# Altium project WunderBar_v102b.PrjPCB
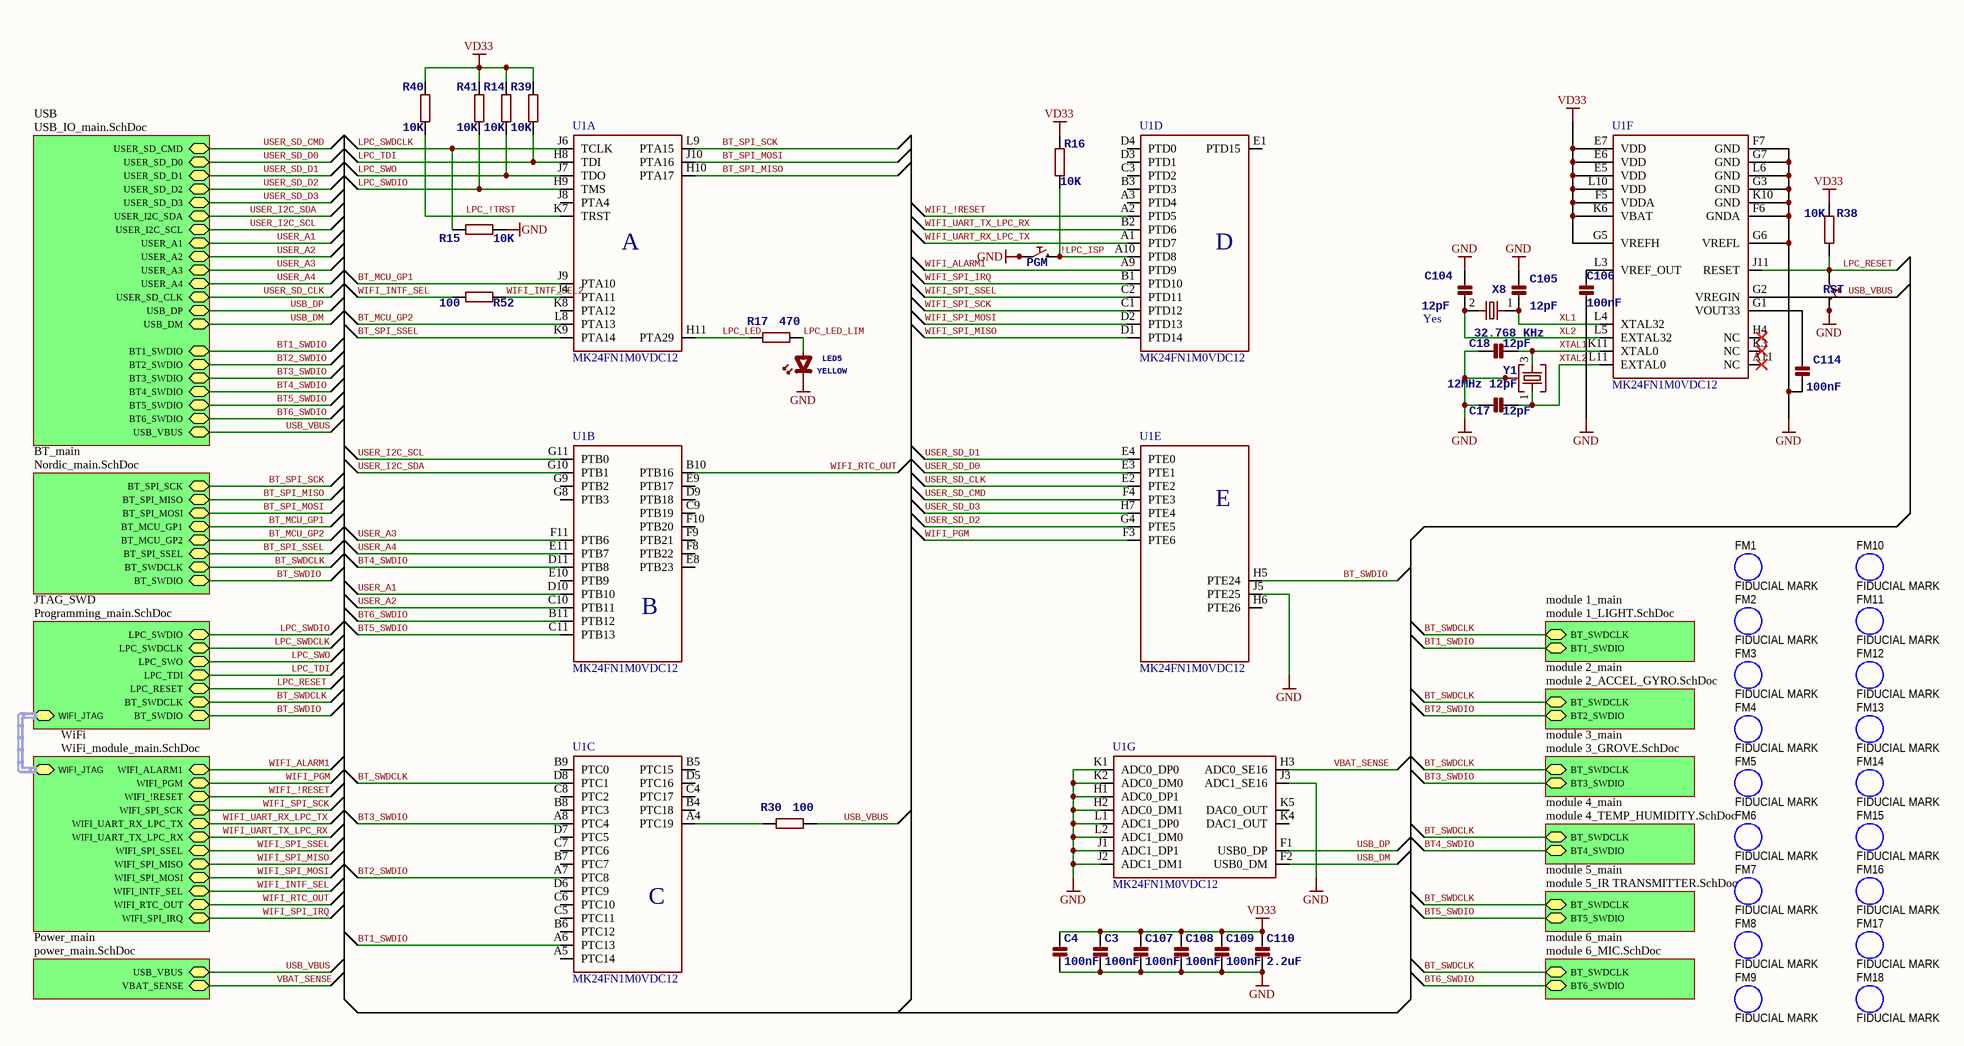
[diagram p0: WunderBar_v102b.SchDoc]
12 sheets, 377 parts. Net scope: hierarchical (ports join the sheet entries above them; power ports are global).
Board file: WunderBar_v102b.PcbDoc
Sheets:
  WunderBar_v102b.SchDoc
    WiFi = WiFi_module_main.SchDoc
    BT_main = Nordic_main.SchDoc
    USB = USB_IO_main.SchDoc
    JTAG_SWD = Programming_main.SchDoc
    module 1_main = module 1_LIGHT.SchDoc
    module 2_main = module 2_ACCEL_GYRO.SchDoc
    module 3_main = module 3_GROVE.SchDoc
    module 4_main = module 4_TEMP_HUMIDITY.SchDoc
    module 5_main = module 5_IR TRANSMITTER.SchDoc
    module 6_main = module 6_MIC.SchDoc
    Power_main = power_main.SchDoc

## Sheet WunderBar_v102b.SchDoc
size A2

### Parts
C3  100nF  [0402]
C4  100nF  [0402]
C17  12pF  [0402]
C18  12pF  [0402]
C104  12pF  SMD: Yes  [0402]
C105  12pF  [0402]
C106  100nF  [0402]
C107  100nF  [0402]
C108  100nF  [0402]
C109  100nF  [0402]
C110  2.2uF  [0603]
C114  100nF  [0402]
FM1  FIDUCIAL MARK  [FIDUCIAL MARK 0.6MM]  (no BOM)
FM2  FIDUCIAL MARK  [FIDUCIAL MARK 0.6MM]  (no BOM)
FM3  FIDUCIAL MARK  [FIDUCIAL MARK 0.6MM]  (no BOM)
FM4  FIDUCIAL MARK  [FIDUCIAL MARK 0.6MM]  (no BOM)
FM5  FIDUCIAL MARK  [FIDUCIAL MARK 0.6MM]  (no BOM)
FM6  FIDUCIAL MARK  [FIDUCIAL MARK 0.6MM]  (no BOM)
FM7  FIDUCIAL MARK  [FIDUCIAL MARK 0.6MM]  (no BOM)
FM8  FIDUCIAL MARK  [FIDUCIAL MARK 0.6MM]  (no BOM)
FM9  FIDUCIAL MARK  [FIDUCIAL MARK 0.6MM]  (no BOM)
FM10  FIDUCIAL MARK  [FIDUCIAL MARK 0.6MM]  (no BOM)
FM11  FIDUCIAL MARK  [FIDUCIAL MARK 0.6MM]  (no BOM)
FM12  FIDUCIAL MARK  [FIDUCIAL MARK 0.6MM]  (no BOM)
FM13  FIDUCIAL MARK  [FIDUCIAL MARK 0.6MM]  (no BOM)
FM14  FIDUCIAL MARK  [FIDUCIAL MARK 0.6MM]  (no BOM)
FM15  FIDUCIAL MARK  [FIDUCIAL MARK 0.6MM]  (no BOM)
FM16  FIDUCIAL MARK  [FIDUCIAL MARK 0.6MM]  (no BOM)
FM17  FIDUCIAL MARK  [FIDUCIAL MARK 0.6MM]  (no BOM)
FM18  FIDUCIAL MARK  [FIDUCIAL MARK 0.6MM]  (no BOM)
LED5  YELLOW  [0402_POLAR]
PGM  Tact Sw 4.6x2.8  [CK-KMR2]  (value not drawn)
R14  10K  [0402]
R15  10K  [0402]
R16  10K  [0402]
R17  470  [0402]
R30  100  [0402]
R38  10K  [0402]
R39  10K  [0402]
R40  10K  [0402]
R41  10K  [0402]
R52  100  [0402]
RST  Tact Sw 4.6x2.8  [CK-KMR2]  (value not drawn)
U1  MK24FN1M0VDC12  [BGA121-0.65]  (parts A,B,C,D,E,F,G of 7)
X8  32.768 KHz  [1206_MINIMELF_COMBO]
Y1  12MHz 12pF  [ABM8G]

### Sub-sheets
BT_main = Nordic_main.SchDoc: BT_SPI_SCK, BT_SPI_MISO, BT_SPI_MOSI, BT_MCU_GP1, BT_MCU_GP2, BT_SPI_SSEL, BT_SWDCLK, BT_SWDIO
JTAG_SWD = Programming_main.SchDoc: LPC_SWDIO, LPC_SWDCLK, LPC_SWO, LPC_TDI, LPC_RESET, WIFI_JTAG (harness WIFI_JTAG), BT_SWDCLK, BT_SWDIO
module 1_main = module 1_LIGHT.SchDoc: BT_SWDCLK, BT1_SWDIO
module 2_main = module 2_ACCEL_GYRO.SchDoc: BT_SWDCLK, BT2_SWDIO
module 3_main = module 3_GROVE.SchDoc: BT_SWDCLK, BT3_SWDIO
module 4_main = module 4_TEMP_HUMIDITY.SchDoc: BT_SWDCLK, BT4_SWDIO
module 5_main = module 5_IR TRANSMITTER.SchDoc: BT_SWDCLK, BT5_SWDIO
module 6_main = module 6_MIC.SchDoc: BT_SWDCLK, BT6_SWDIO
Power_main = power_main.SchDoc: USB_VBUS, VBAT_SENSE
USB = USB_IO_main.SchDoc: USER_SD_CMD, USER_SD_D0, USER_SD_D1, USER_SD_D2, USER_SD_D3, USER_I2C_SDA, USER_I2C_SCL, USER_A1, USER_A2, USER_A3, USER_A4, USER_SD_CLK, USB_DP, USB_DM, BT1_SWDIO, BT2_SWDIO, BT3_SWDIO, BT4_SWDIO, BT5_SWDIO, BT6_SWDIO, USB_VBUS
WiFi = WiFi_module_main.SchDoc: WIFI_ALARM1, WIFI_PGM, WIFI_!RESET, WIFI_SPI_SCK, WIFI_UART_RX_LPC_TX, WIFI_UART_TX_LPC_RX, WIFI_SPI_SSEL, WIFI_SPI_MISO, WIFI_SPI_MOSI, WIFI_INTF_SEL, WIFI_RTC_OUT, WIFI_SPI_IRQ, WIFI_JTAG (harness WIFI_JTAG)

### Nets
GND: C3.2 C4.2 C17.2 C18.2 C104.2 C105.2 C106.2 C107.2 C108.2 C109.2 C110.2 C114.1 LED5.K(CATHODE) PGM.P1 PGM.P2 R15.2 RST.P3 RST.P4 U1.F6(GNDA) U1.F7(GND) U1.G3(GND) U1.G6(VREFL) U1.G7(GND) U1.H1(ADC0_DP1) U1.H2(ADC0_DM1) U1.J1(ADC1_DP1) U1.J2(ADC1_DM1) U1.J3(ADC1_SE16) U1.J5(PTE25) U1.K1(ADC0_DP0) U1.K2(ADC0_DM0) U1.K10(GND) U1.L1(ADC1_DP0) U1.L2(ADC1_DM0) U1.L6(GND) Y1.2(GND) Y1.4(GND)
USB_VBUS: R30.1 U1.G2(VREGIN) ; sheet USB/USB_VBUS, sheet Power_main/USB_VBUS
VD33: C3.1 C4.1 C107.1 C108.1 C109.1 C110.1 R14.2 R16.2 R38.2 R39.2 R40.2 R41.2 U1.E5(VDD) U1.E6(VDD) U1.E7(VDD) U1.F5(VDDA) U1.G5(VREFH) U1.K6(VBAT) U1.L10(VDD)
!LPC_ISP: PGM.P3 PGM.P4 R16.1 U1.A10(PTD8)
BT1_SWDIO: U1.A6(PTC13) ; sheet USB/BT1_SWDIO, sheet module 1_main/BT1_SWDIO
BT2_SWDIO: U1.A7(PTC8) ; sheet USB/BT2_SWDIO, sheet module 2_main/BT2_SWDIO
BT3_SWDIO: U1.A8(PTC4) ; sheet USB/BT3_SWDIO, sheet module 3_main/BT3_SWDIO
BT4_SWDIO: U1.D11(PTB8) ; sheet USB/BT4_SWDIO, sheet module 4_main/BT4_SWDIO
BT5_SWDIO: U1.C11(PTB13) ; sheet USB/BT5_SWDIO, sheet module 5_main/BT5_SWDIO
BT6_SWDIO: U1.B11(PTB12) ; sheet USB/BT6_SWDIO, sheet module 6_main/BT6_SWDIO
BT_MCU_GP1: U1.J9(PTA10) ; sheet BT_main/BT_MCU_GP1
BT_MCU_GP2: U1.L8(PTA13) ; sheet BT_main/BT_MCU_GP2
BT_SPI_MISO: U1.H10(PTA17) ; sheet BT_main/BT_SPI_MISO
BT_SPI_MOSI: U1.J10(PTA16) ; sheet BT_main/BT_SPI_MOSI
BT_SPI_SCK: U1.L9(PTA15) ; sheet BT_main/BT_SPI_SCK
BT_SPI_SSEL: U1.K9(PTA14) ; sheet BT_main/BT_SPI_SSEL
BT_SWDCLK: U1.D8(PTC1) ; sheet BT_main/BT_SWDCLK, sheet JTAG_SWD/BT_SWDCLK, sheet module 1_main/BT_SWDCLK, sheet module 2_main/BT_SWDCLK, sheet module 3_main/BT_SWDCLK, sheet module 4_main/BT_SWDCLK, sheet module 5_main/BT_SWDCLK, sheet module 6_main/BT_SWDCLK
BT_SWDIO: U1.H5(PTE24) ; sheet BT_main/BT_SWDIO, sheet JTAG_SWD/BT_SWDIO
LPC_!TRST: R40.1 U1.K7(TRST)
LPC_LED: R17.2 U1.H11(PTA29)
LPC_LED_LIM: LED5.A(ANODE) R17.1
LPC_RESET: R38.1 RST.P1 RST.P2 U1.J11(RESET) ; sheet JTAG_SWD/LPC_RESET  [project net ~{LPC_RESET}]
LPC_SWDCLK: R15.1 U1.J6(TCLK) ; sheet JTAG_SWD/LPC_SWDCLK
LPC_SWDIO: R41.1 U1.H9(TMS) ; sheet JTAG_SWD/LPC_SWDIO
LPC_SWO: R14.1 U1.J7(TDO) ; sheet JTAG_SWD/LPC_SWO
LPC_TDI: R39.1 U1.H8(TDI) ; sheet JTAG_SWD/LPC_TDI
USB_DM: U1.F2(USB0_DM) ; sheet USB/USB_DM
USB_DP: U1.F1(USB0_DP) ; sheet USB/USB_DP
USER_A1: U1.D10(PTB10) ; sheet USB/USER_A1
USER_A2: U1.C10(PTB11) ; sheet USB/USER_A2
USER_A3: U1.F11(PTB6) ; sheet USB/USER_A3
USER_A4: U1.E11(PTB7) ; sheet USB/USER_A4
USER_I2C_SCL: U1.G11(PTB0) ; sheet USB/USER_I2C_SCL
USER_I2C_SDA: U1.G10(PTB1) ; sheet USB/USER_I2C_SDA
USER_SD_CLK: U1.E2(PTE2) ; sheet USB/USER_SD_CLK
USER_SD_CMD: U1.F4(PTE3) ; sheet USB/USER_SD_CMD
USER_SD_D0: U1.E3(PTE1) ; sheet USB/USER_SD_D0
USER_SD_D1: U1.E4(PTE0) ; sheet USB/USER_SD_D1
USER_SD_D2: U1.G4(PTE5) ; sheet USB/USER_SD_D2
USER_SD_D3: U1.H7(PTE4) ; sheet USB/USER_SD_D3
VBAT_SENSE: U1.H3(ADC0_SE16) ; sheet Power_main/VBAT_SENSE
WIFI_!RESET: U1.A2(PTD5) ; sheet WiFi/WIFI_!RESET
WIFI_ALARM1: U1.A9(PTD9) ; sheet WiFi/WIFI_ALARM1
WIFI_INTF_SEL: R52.1 ; sheet WiFi/WIFI_INTF_SEL
WIFI_INTF_SEL2: R52.2 U1.J4(PTA11)
WIFI_PGM: U1.F3(PTE6) ; sheet WiFi/WIFI_PGM
WIFI_RTC_OUT: U1.B10(PTB16) ; sheet WiFi/WIFI_RTC_OUT
WIFI_SPI_IRQ: U1.B1(PTD10) ; sheet WiFi/WIFI_SPI_IRQ
WIFI_SPI_MISO: U1.D1(PTD14) ; sheet WiFi/WIFI_SPI_MISO
WIFI_SPI_MOSI: U1.D2(PTD13) ; sheet WiFi/WIFI_SPI_MOSI
WIFI_SPI_SCK: U1.C1(PTD12) ; sheet WiFi/WIFI_SPI_SCK
WIFI_SPI_SSEL: U1.C2(PTD11) ; sheet WiFi/WIFI_SPI_SSEL
WIFI_UART_RX_LPC_TX: U1.A1(PTD7) ; sheet WiFi/WIFI_UART_RX_LPC_TX
WIFI_UART_TX_LPC_RX: U1.B2(PTD6) ; sheet WiFi/WIFI_UART_TX_LPC_RX
XL1: C105.1 U1.L4(XTAL32) X8.1
XL2: C104.1 U1.L5(EXTAL32) X8.2
XTAL1: C18.1 U1.K11(XTAL0) Y1.3
XTAL2: C17.1 U1.L11(EXTAL0) Y1.1
NetC106_1: C106.1 U1.L3(VREF_OUT)
NetC114_2: C114.2 U1.G1(VOUT33)
NetR30_2: R30.2 U1.A4(PTC19)

Not connected (* = marked no-connect by the designer): U1 A3(PTD4) A5(PTC14) A11(NC)* B3(PTD3) B4(PTC18) B5(PTC15) B6(PTC12) B7(PTC7) B8(PTC3) B9(PTC0) C3(PTD2) C4(PTC17) C5(PTC11) C6(PTC10) C7(PTC6) C8(PTC2) C9(PTB19) D3(PTD1) D4(PTD0) D5(PTC16) D6(PTC9) D7(PTC5) D9(PTB18) E1(PTD15) E8(PTB23) E9(PTB17) E10(PTB9) F8(PTB22) F9(PTB21) F10(PTB20) G8(PTB3) G9(PTB2) H4(NC)* H6(PTE26) J8(PTA4) K3(NC)* K4(DAC1_OUT) K5(DAC0_OUT) K8(PTA12)

### Buses and harness runs
harness sheet JTAG_SWD/WIFI_JTAG = sheet WiFi/WIFI_JTAG

### Notes on the sheet
- (in symbol MK24FN1M0VDC12, part A) A
- (in symbol MK24FN1M0VDC12, part B) B
- (in symbol MK24FN1M0VDC12, part C) C
- (in symbol MK24FN1M0VDC12, part D) D
- (in symbol MK24FN1M0VDC12, part E) E

### Library data of the parts
C3 C4 C17 C18 C104-C110 C114 = CAP_CERAMIC0402: Ceramic capacitor
  C3 C4 C17 C18 C105-C110 C114: SMD: Yes
LED5 = LED0402: LED common; SMD: Yes
PGM RST = PUSHBUTTONKMR2XX: Push button; SMD: Yes
R14-R17 R30 R38-R41 R52 = R-EU_0402: RESISTOR; SMD: Yes
U1 = MK24FN1M0VDC12: MK24FN1M0VDC12 121-PIN BGA Microcontroller; SMD: Yes
X8 = CRYSTAL1206: CL05C120JB5; 1: 1; 2: 2; SMD: Yes
Y1 = CRYSTAL_WITH_GROUNDABM8G: CX2520DB16000D0GEJCC; 1: 1; 2: 2; SMD: Yes
FM1-FM18 = FIDUCIAL MARK: SMD: Fiducial

## Sheet WiFi_module_main.SchDoc
size A3
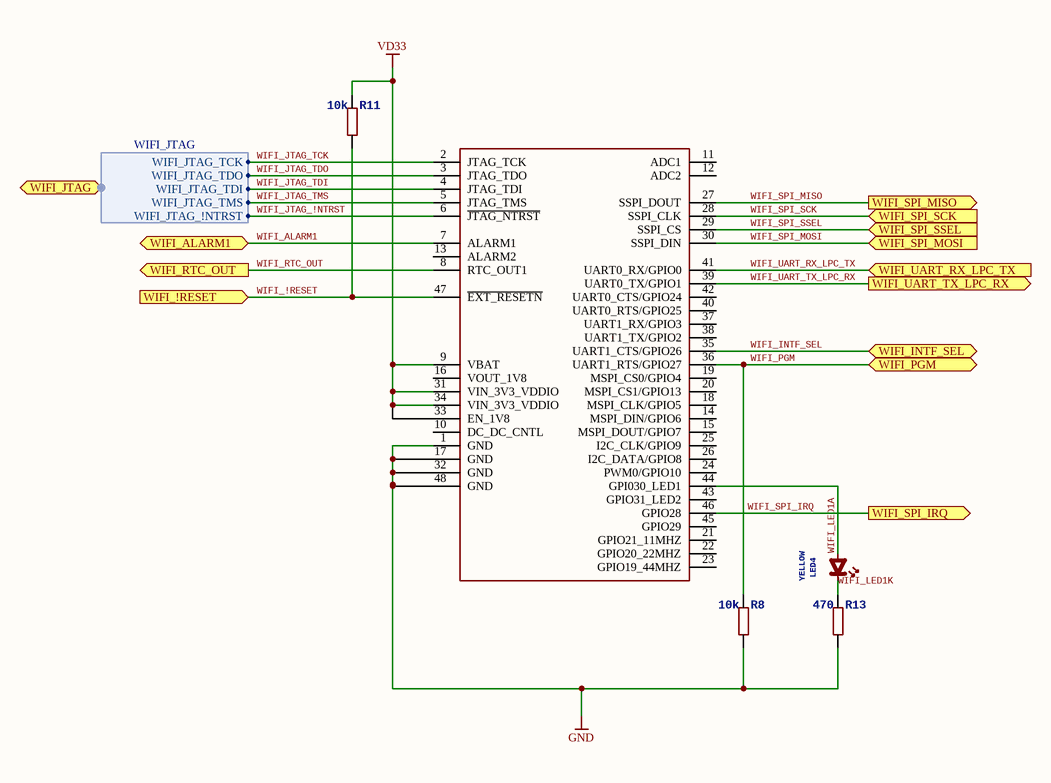
[diagram p1: WiFi_module_main.SchDoc]

### Parts
LED4  YELLOW  [0402_POLAR]
R8  10k  [0402]
R11  10k  [0402]
R13  470  [0402]
WIFI  GS1500M  [GAINSPANM]  (value not drawn)

### Ports
WIFI_!RESET (in), WIFI_ALARM1, WIFI_INTF_SEL, WIFI_JTAG (harness WIFI_JTAG), WIFI_PGM, WIFI_RTC_OUT (out), WIFI_SPI_IRQ (out), WIFI_SPI_MISO (out), WIFI_SPI_MOSI (in), WIFI_SPI_SCK (in), WIFI_SPI_SSEL (in), WIFI_UART_RX_LPC_TX (in), WIFI_UART_TX_LPC_RX (out)

### Harnesses
WIFI_JTAG: WIFI_JTAG_TCK, WIFI_JTAG_TDO, WIFI_JTAG_TDI, WIFI_JTAG_TMS, WIFI_JTAG_!NTRST

### Nets
GND: R8.1 R13.1 WIFI.1(GND) WIFI.17(GND) WIFI.32(GND) WIFI.48(GND)
VD33: R11.2 WIFI.9(VBAT) WIFI.31(VIN_3V3_VDDIO) WIFI.33(EN_1V8) WIFI.34(VIN_3V3_VDDIO)
WIFI_!RESET: R11.1 WIFI.47(~{EXT_RESETN}) ; port WIFI_!RESET
WIFI_ALARM1: WIFI.7(ALARM1) ; port WIFI_ALARM1
WIFI_INTF_SEL: WIFI.35(UART1_CTS/GPIO26) ; port WIFI_INTF_SEL
WIFI_JTAG_!NTRST: WIFI.6(~{JTAG_NTRST}) ; port WIFI_JTAG.WIFI_JTAG_!NTRST
WIFI_JTAG_TCK: WIFI.2(JTAG_TCK) ; port WIFI_JTAG.WIFI_JTAG_TCK
WIFI_JTAG_TDI: WIFI.4(JTAG_TDI) ; port WIFI_JTAG.WIFI_JTAG_TDI
WIFI_JTAG_TDO: WIFI.3(JTAG_TDO) ; port WIFI_JTAG.WIFI_JTAG_TDO
WIFI_JTAG_TMS: WIFI.5(JTAG_TMS) ; port WIFI_JTAG.WIFI_JTAG_TMS
WIFI_LED1A: LED4.A(ANODE) WIFI.44(GPI030_LED1)
WIFI_LED1K: LED4.K(CATHODE) R13.2
WIFI_PGM: R8.2 WIFI.36(UART1_RTS/GPIO27) ; port WIFI_PGM
WIFI_RTC_OUT: WIFI.8(RTC_OUT1) ; port WIFI_RTC_OUT
WIFI_SPI_IRQ: WIFI.46(GPIO28) ; port WIFI_SPI_IRQ
WIFI_SPI_MISO: WIFI.27(SSPI_DOUT) ; port WIFI_SPI_MISO
WIFI_SPI_MOSI: WIFI.30(SSPI_DIN) ; port WIFI_SPI_MOSI
WIFI_SPI_SCK: WIFI.28(SSPI_CLK) ; port WIFI_SPI_SCK
WIFI_SPI_SSEL: WIFI.29(SSPI_CS) ; port WIFI_SPI_SSEL
WIFI_UART_RX_LPC_TX: WIFI.41(UART0_RX/GPIO0) ; port WIFI_UART_RX_LPC_TX
WIFI_UART_TX_LPC_RX: WIFI.39(UART0_TX/GPIO1) ; port WIFI_UART_TX_LPC_RX

Not connected (* = marked no-connect by the designer): WIFI 10(DC_DC_CNTL) 11(ADC1) 12(ADC2) 13(ALARM2) 14(MSPI_DIN/GPIO6) 15(MSPI_DOUT/GPIO7) 16(VOUT_1V8) 18(MSPI_CLK/GPIO5) 19(MSPI_CS0/GPIO4) 20(MSPI_CS1/GPIO13) 21(GPIO21_11MHZ) 22(GPIO20_22MHZ) 23(GPIO19_44MHZ) 24(PWM0/GPIO10) 25(I2C_CLK/GPIO9) 26(I2C_DATA/GPIO8) 37(UART1_RX/GPIO3) 38(UART1_TX/GPIO2) 40(UART0_RTS/GPIO25) 42(UART0_CTS/GPIO24) 43(GPIO31_LED2) 45(GPIO29)

### Library data of the parts
LED4 = LED0402: LED common; SMD: Yes
R8 R11 R13 = R-EU_0402: RESISTOR; SMD: Yes
WIFI = GAINSPAN1500MXXGAINSPANMEXP: GAINSPAN WiFi module; SMD: Yes

## Sheet Nordic_main.SchDoc
size A3
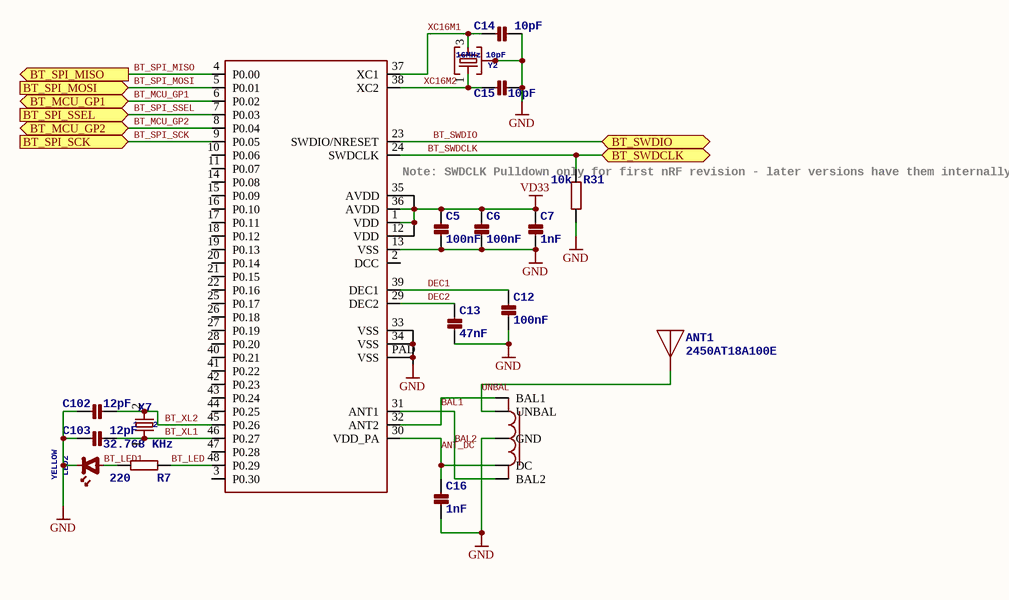
[diagram p2: Nordic_main.SchDoc]

### Parts
ANT1  2450AT18A100E  [1206_MINIMELF_COMBO]
BALUN  2450BM14A0002T  [6-PIN-0603]  (value not drawn)
BT  NRF51822QFN48  [QFN48_EP]  (value not drawn)
C5  100nF  [0402]
C6  100nF  [0402]
C7  1nF  [0402]
C12  100nF  [0402]
C13  47nF  [0402]
C14  10pF  [0402]
C15  10pF  [0402]
C16  1nF  [0402]
C102  12pF  [0402]
C103  12pF  [0402]
LED2  YELLOW  [0402_POLAR]
R7  220  [0402]
R31  10k  [0402]
X7  32.768 KHz  [1206_MINIMELF_COMBO]
Y2  16MHz 10pF  [CRYSTAL25X20]

### Ports
BT_MCU_GP1, BT_MCU_GP2, BT_SPI_MISO (out), BT_SPI_MOSI (in), BT_SPI_SCK (in), BT_SPI_SSEL (in), BT_SWDCLK, BT_SWDIO

### Nets
GND: BALUN.2(GND) BT.13(VSS) BT.33(VSS) BT.34(VSS) BT.PAD(VSS) C5.2 C6.2 C7.2 C12.2 C13.2 C14.2 C15.2 C16.2 C102.1 C103.1 LED2.K(CATHODE) R31.1 Y2.2 Y2.4
VD33: BT.1(VDD) BT.12(VDD) BT.35(AVDD) BT.36(AVDD) C5.1 C6.1 C7.1
ANT_DC: BALUN.5(DC) BT.30(VDD_PA) C16.1
BAL1: BALUN.3(BAL1) BT.32(ANT2)
BAL2: BALUN.4(BAL2) BT.31(ANT1)
BT_LED: BT.48(P0.29) R7.1
BT_LED1: LED2.A(ANODE) R7.2
BT_MCU_GP1: BT.6(P0.02) ; port BT_MCU_GP1
BT_MCU_GP2: BT.8(P0.04) ; port BT_MCU_GP2
BT_SPI_MISO: BT.4(P0.00) ; port BT_SPI_MISO
BT_SPI_MOSI: BT.5(P0.01) ; port BT_SPI_MOSI
BT_SPI_SCK: BT.9(P0.05) ; port BT_SPI_SCK
BT_SPI_SSEL: BT.7(P0.03) ; port BT_SPI_SSEL
BT_SWDCLK: BT.24(SWDCLK) R31.2 ; port BT_SWDCLK
BT_SWDIO: BT.23(SWDIO/NRESET) ; port BT_SWDIO
BT_XL1: BT.46(P0.27) C103.2 X7.1
BT_XL2: BT.45(P0.26) C102.2 X7.2
DEC1: BT.39(DEC1) C12.1
DEC2: BT.29(DEC2) C13.1
UNBAL: ANT1.1(ANT) BALUN.1(UNBAL)
XC16M1: BT.37(XC1) C14.1 Y2.3
XC16M2: BT.38(XC2) C15.1 Y2.1

Not connected (* = marked no-connect by the designer): BT 2(DCC) 3(P0.30) 10(P0.06) 11(P0.07) 14(P0.08) 15(P0.09) 16(P0.10) 17(P0.11) 18(P0.12) 19(P0.13) 20(P0.14) 21(P0.15) 22(P0.16) 25(P0.17) 26(P0.18) 27(P0.19) 28(P0.20) 40(P0.21) 41(P0.22) 42(P0.23) 43(P0.24) 44(P0.25) 47(P0.28)

### Notes on the sheet
- (near R31) Note: SWDCLK Pulldown only for first nRF revision - later versions have them internally

### Library data of the parts
ANT1 = ANTENNA_MONOPOLE1206: 2.45 GHz Antenna; SMD: Yes
BALUN = BALUN: 2.45 GHz Impedance Matched Balun-Filter; SMD: Yes
BT = NRF51822QFN48: Nordic Bluetooth 4.0 low energy modul; SMD: Yes
C5-C7 C12-C16 C102 C103 = CAP_CERAMIC0402: Ceramic Capacitor; SMD: Yes
LED2 = LED0402: LED common; SMD: Yes
R7 R31 = R-EU_0402: RESISTOR; SMD: Yes
X7 = CRYSTAL1206: CL05C120JB5; 1: 1; 2: 2; SMD: Yes
Y2 = CRYSTAL_WITH_GROUND25X20: 16MHz crystal 2.5x2mm; SMD: Yes

## Sheet USB_IO_main.SchDoc
size A4
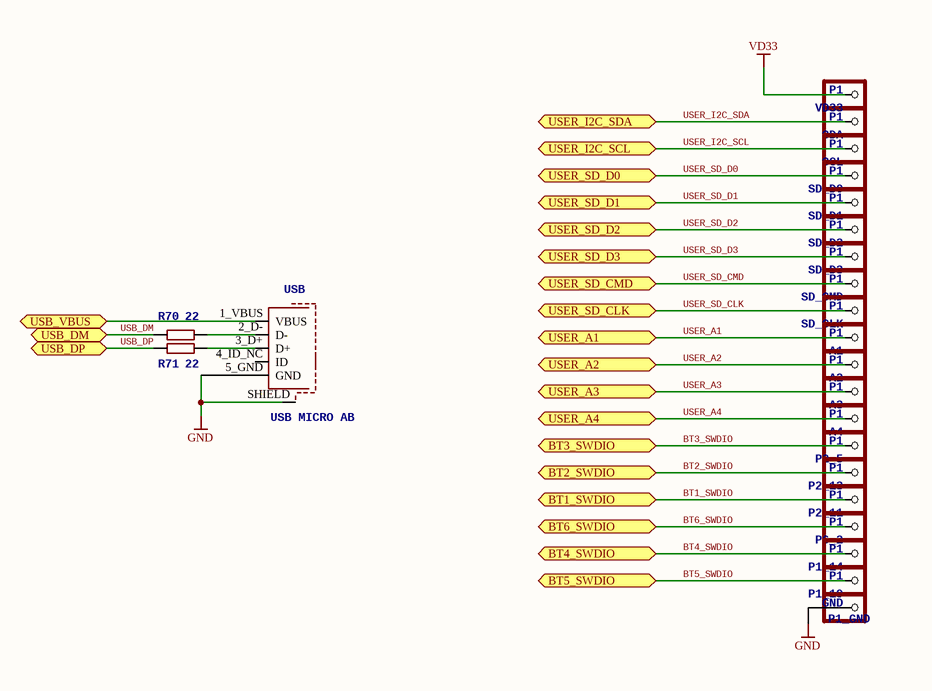
[diagram p3: USB_IO_main.SchDoc]

### Parts
A1  P1  [PCB_MEDIUM_RECT_PAD]  (no BOM)
A2  P1  [PCB_MEDIUM_RECT_PAD]  (no BOM)
A3  P1  [PCB_MEDIUM_RECT_PAD]  (no BOM)
A4  P1  [PCB_MEDIUM_RECT_PAD]  (no BOM)
P1_14  P1  [PCB_MEDIUM_RECT_PAD]  (no BOM)
P1_19  P1  [PCB_MEDIUM_RECT_PAD]  (no BOM)
P1_GND  GND  [PCB_MEDIUM_RECT_PAD]  (no BOM)
P2_5  P1  [PCB_MEDIUM_RECT_PAD]  (no BOM)
P2_11  P1  [PCB_MEDIUM_RECT_PAD]  (no BOM)
P2_13  P1  [PCB_MEDIUM_RECT_PAD]  (no BOM)
P6_2  P1  [PCB_MEDIUM_RECT_PAD]  (no BOM)
R70  22  [0402]
R71  22  [0402]
SCL  P1  [PCB_MEDIUM_RECT_PAD]  (no BOM)
SD_CLK  P1  [PCB_MEDIUM_RECT_PAD]  (no BOM)
SD_CMD  P1  [PCB_MEDIUM_RECT_PAD]  (no BOM)
SD_D0  P1  [PCB_MEDIUM_RECT_PAD]  (no BOM)
SD_D1  P1  [PCB_MEDIUM_RECT_PAD]  (no BOM)
SD_D2  P1  [PCB_MEDIUM_RECT_PAD]  (no BOM)
SD_D3  P1  [PCB_MEDIUM_RECT_PAD]  (no BOM)
SDA  P1  [PCB_MEDIUM_RECT_PAD]  (no BOM)
USB  USB MICRO AB  [USB_MICRO_SMD]
VD33  P1  [PCB_MEDIUM_RECT_PAD]  (no BOM)

### Ports
BT1_SWDIO, BT2_SWDIO, BT3_SWDIO, BT4_SWDIO, BT5_SWDIO, BT6_SWDIO, USB_DM, USB_DP, USB_VBUS, USER_A1, USER_A2, USER_A3, USER_A4, USER_I2C_SCL, USER_I2C_SDA, USER_SD_CLK, USER_SD_CMD, USER_SD_D0, USER_SD_D1, USER_SD_D2, USER_SD_D3

### Nets
GND: P1_GND.1 USB.5_GND(GND) USB.SHIELD
USB_VBUS: USB.1_VBUS(VBUS) ; port USB_VBUS
VD33: VD33.1
BT1_SWDIO: P2_11.1 ; port BT1_SWDIO
BT2_SWDIO: P2_13.1 ; port BT2_SWDIO
BT3_SWDIO: P2_5.1 ; port BT3_SWDIO
BT4_SWDIO: P1_14.1 ; port BT4_SWDIO
BT5_SWDIO: P1_19.1 ; port BT5_SWDIO
BT6_SWDIO: P6_2.1 ; port BT6_SWDIO
USB_DM: R70.2 ; port USB_DM
USB_DP: R71.2 ; port USB_DP
USER_A1: A1.1 ; port USER_A1
USER_A2: A2.1 ; port USER_A2
USER_A3: A3.1 ; port USER_A3
USER_A4: A4.1 ; port USER_A4
USER_I2C_SCL: SCL.1 ; port USER_I2C_SCL
USER_I2C_SDA: SDA.1 ; port USER_I2C_SDA
USER_SD_CLK: SD_CLK.1 ; port USER_SD_CLK
USER_SD_CMD: SD_CMD.1 ; port USER_SD_CMD
USER_SD_D0: SD_D0.1 ; port USER_SD_D0
USER_SD_D1: SD_D1.1 ; port USER_SD_D1
USER_SD_D2: SD_D2.1 ; port USER_SD_D2
USER_SD_D3: SD_D3.1 ; port USER_SD_D3
NetR70_1: R70.1 USB.2_D-(D-)
NetR71_1: R71.1 USB.3_D+(D+)

Not connected (* = marked no-connect by the designer): USB 4_ID_NC(ID)

### Library data of the parts
A1-A4 P1_14 P1_19 P1_GND P2_5 P2_11 P2_13 P6_2 SCL SD_CLK SD_CMD SD_D0-SD_D3 SDA VD33 = HEADER-1X1SMD_MEDIUM: <b>PIN HEADER</b>
R70 R71 = R-EU_0402: RESISTOR; SMD: Yes
USB = USB_MICROSMD: Micro USB right angle (AB) connector; USB: USB; SMD: Yes

## Sheet Programming_main.SchDoc
size A4 portrait
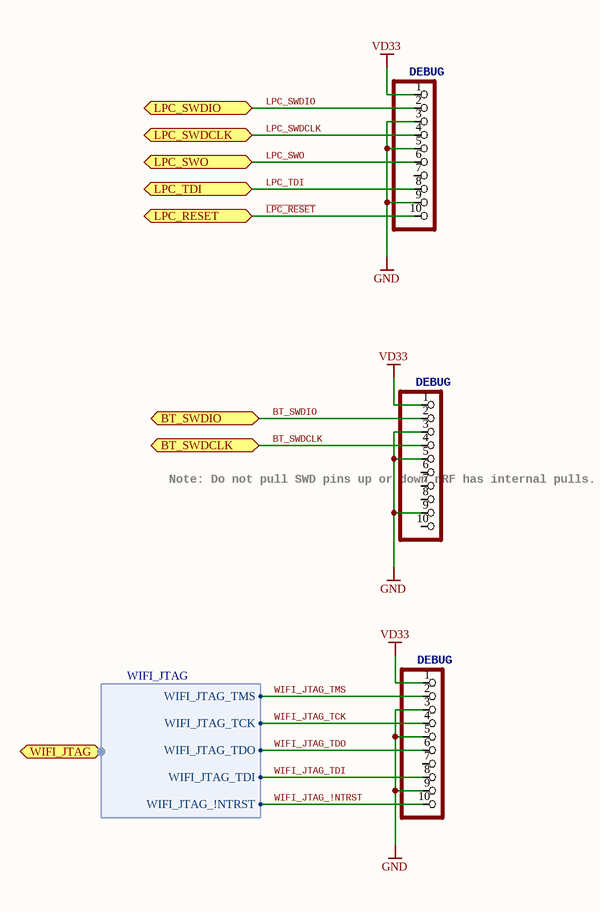
[diagram p4: Programming_main.SchDoc]

### Parts
LPC_DEBUG  DEBUG  [2X05_SMT]  (no BOM)
NRF_DEBUG  DEBUG  [2X05_SMT]  (no BOM)
WIFI_DEBUG  DEBUG  [2X05_SMT]  (no BOM)

### Ports
BT_SWDCLK, BT_SWDIO, LPC_RESET, LPC_SWDCLK, LPC_SWDIO, LPC_SWO, LPC_TDI, WIFI_JTAG (harness WIFI_JTAG)

### Harnesses
WIFI_JTAG: WIFI_JTAG_TCK, WIFI_JTAG_TDO, WIFI_JTAG_TDI, WIFI_JTAG_TMS, WIFI_JTAG_!NTRST

### Nets
GND: LPC_DEBUG.3 LPC_DEBUG.5 LPC_DEBUG.9 NRF_DEBUG.3 NRF_DEBUG.5 NRF_DEBUG.9 WIFI_DEBUG.3 WIFI_DEBUG.5 WIFI_DEBUG.9
VD33: LPC_DEBUG.1 NRF_DEBUG.1 WIFI_DEBUG.1
BT_SWDCLK: NRF_DEBUG.4 ; port BT_SWDCLK
BT_SWDIO: NRF_DEBUG.2 ; port BT_SWDIO
~{LPC_RESET}: LPC_DEBUG.10 ; port LPC_RESET
LPC_SWDCLK: LPC_DEBUG.4 ; port LPC_SWDCLK
LPC_SWDIO: LPC_DEBUG.2 ; port LPC_SWDIO
LPC_SWO: LPC_DEBUG.6 ; port LPC_SWO
LPC_TDI: LPC_DEBUG.8 ; port LPC_TDI
WIFI_JTAG_!NTRST: WIFI_DEBUG.10 ; port WIFI_JTAG.WIFI_JTAG_!NTRST
WIFI_JTAG_TCK: WIFI_DEBUG.4 ; port WIFI_JTAG.WIFI_JTAG_TCK
WIFI_JTAG_TDI: WIFI_DEBUG.8 ; port WIFI_JTAG.WIFI_JTAG_TDI
WIFI_JTAG_TDO: WIFI_DEBUG.6 ; port WIFI_JTAG.WIFI_JTAG_TDO
WIFI_JTAG_TMS: WIFI_DEBUG.2 ; port WIFI_JTAG.WIFI_JTAG_TMS

Not connected (* = marked no-connect by the designer): LPC_DEBUG 7; NRF_DEBUG 6 7 8 10; WIFI_DEBUG 7

### Notes on the sheet
- (near NRF_DEBUG) Note:
  Do not pull SWD pins up or down
  nRF has internal pulls.

### Library data of the parts
LPC_DEBUG NRF_DEBUG WIFI_DEBUG = HEADER-2X5SMD-1.27MM: cortex DEBUG connector

## Sheet module 1_LIGHT.SchDoc
size 263 x 148 mm
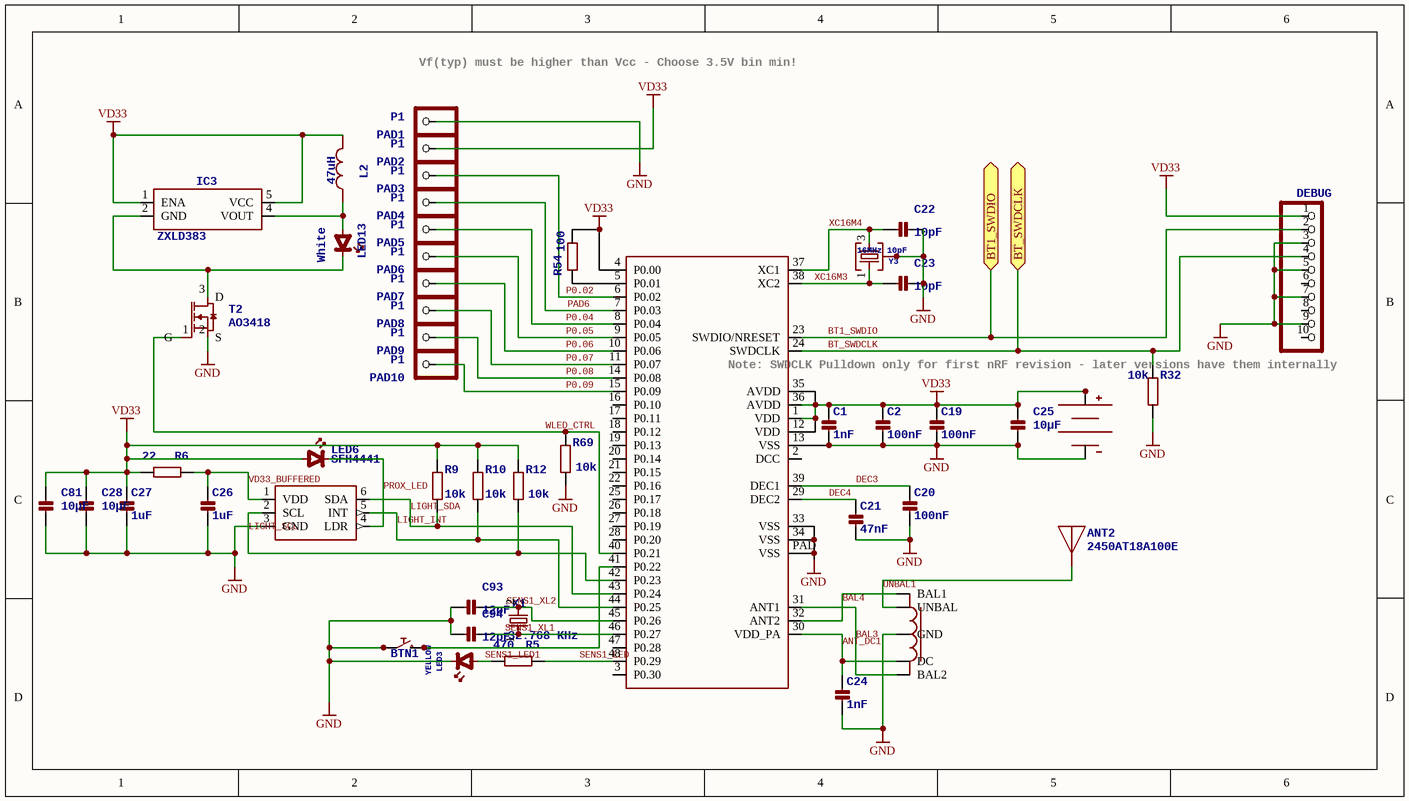
[diagram p5: module 1_LIGHT.SchDoc]

### Parts
ANT2  2450AT18A100E  [1206_MINIMELF_COMBO]
BALUN1  2450BM14A0002T  [6-PIN-0603]  (value not drawn)
BAT1  BATTERYBK-912  [BK-912]  (value not drawn)
BT1  NRF51822QFN48  [QFN48_EP]  (value not drawn)
BTN1  Tact Sw 4.6x2.8  [CK-KMR2]  (value not drawn)
C1  1nF  [0402]
C2  100nF  [0402]
C19  100nF  [0402]
C20  100nF  [0402]
C21  47nF  [0402]
C22  10pF  [0402]
C23  10pF  [0402]
C24  1nF  [0402]
C25  10µF  [0603]
C26  1uF  [0402]
C27  1uF  [0402]
C28  10µF  [0603]
C81  10µF  [0603]
C93  12pF  [0402]
C94  12pF  [0402]
DEBUG1  DEBUG  [2X05_SMT]  (no BOM)
IC3  ZXLD383  [SOT-23-5]
L2  47uH  [0805_MICROMELF_COMBO]
LED3  YELLOW  [0402_POLAR]
LED6  SFH4441  [MIDLED]
LED13  White  [LED3X2]
PAD1  P1  [PCB_MEDIUM_RECT_PAD]  (no BOM)
PAD2  P1  [PCB_MEDIUM_RECT_PAD]  (no BOM)
PAD3  P1  [PCB_MEDIUM_RECT_PAD]  (no BOM)
PAD4  P1  [PCB_MEDIUM_RECT_PAD]  (no BOM)
PAD5  P1  [PCB_MEDIUM_RECT_PAD]  (no BOM)
PAD6  P1  [PCB_MEDIUM_RECT_PAD]  (no BOM)
PAD7  P1  [PCB_MEDIUM_RECT_PAD]  (no BOM)
PAD8  P1  [PCB_MEDIUM_RECT_PAD]  (no BOM)
PAD9  P1  [PCB_MEDIUM_RECT_PAD]  (no BOM)
PAD10  P1  [PCB_MEDIUM_RECT_PAD]  (no BOM)
R5  470  [0402]
R6  22  [0402]
R9  10k  [0402]
R10  10k  [0402]
R12  10k  [0402]
R32  10k  [0402]
R54  100  [0402]
R69  10k  [0402]
SENSE3  TCS37717FN  [DFN-6-0.65]  (value not drawn)
T2  AO3418  [SOT23]
X1  32.768 KHz  [1206_MINIMELF_COMBO]
Y3  16MHz 10pF  [CRYSTAL25X20]

### Ports
BT1_SWDIO, BT_SWDCLK

### Nets
GND: BALUN1.2(GND) BAT1.- BT1.13(VSS) BT1.33(VSS) BT1.34(VSS) BT1.PAD(VSS) BTN1.P1 BTN1.P2 C1.2 C2.2 C19.2 C20.2 C21.2 C22.2 C23.2 C24.2 C25.2(P2) C26.2 C27.2 C28.2(P2) C81.2(P2) C93.1 C94.1 DEBUG1.3 DEBUG1.5 DEBUG1.7 DEBUG1.9 LED3.K(CATHODE) PAD1.1 R32.1 R69.1 SENSE3.3(GND) T2.2(S) Y3.2 Y3.4
VD33: BAT1.+1(+) BAT1.+2(+) BT1.1(VDD) BT1.4(P0.00) BT1.12(VDD) BT1.35(AVDD) BT1.36(AVDD) C1.1 C2.1 C19.1 C25.1(P1) C27.1 C28.1(P1) C81.1(P1) DEBUG1.1 IC3.1(ENA) IC3.5(VCC) L2.2 LED6.A(ANODE) PAD2.1 R6.1 R9.2 R10.2 R12.2 R54.1
ANT_DC1: BALUN1.5(DC) BT1.30(VDD_PA) C24.1
BAL3: BALUN1.4(BAL2) BT1.31(ANT1)
BAL4: BALUN1.3(BAL1) BT1.32(ANT2)
BT1_SWDIO: BT1.23(SWDIO/NRESET) DEBUG1.2 ; port BT1_SWDIO
BT_SWDCLK: BT1.24(SWDCLK) DEBUG1.4 R32.2 ; port BT_SWDCLK
DEC3: BT1.39(DEC1) C20.1
DEC4: BT1.29(DEC2) C21.1
LIGHT_INT: BT1.44(P0.25) R10.1 SENSE3.5(INT)
LIGHT_SCL: BT1.42(P0.23) R12.1 SENSE3.2(SCL)
LIGHT_SDA: BT1.43(P0.24) R9.1 SENSE3.6(SDA)
P0.02: BT1.6(P0.02) PAD3.1
P0.04: BT1.8(P0.04) PAD5.1
P0.05: BT1.9(P0.05) PAD6.1
P0.06: BT1.10(P0.06) PAD7.1
P0.07: BT1.11(P0.07) PAD8.1
P0.08: BT1.14(P0.08) PAD9.1
P0.09: BT1.15(P0.09) PAD10.1
PAD6: BT1.7(P0.03) PAD4.1
PROX_LED: LED6.C(CATHODE) SENSE3.4(LDR)
SENS1_LED: BT1.48(P0.29) R5.1
SENS1_LED1: LED3.A(ANODE) R5.2
SENS1_XL1: BT1.46(P0.27) C94.2 X1.1
SENS1_XL2: BT1.45(P0.26) C93.2 X1.2
UNBAL1: ANT2.1(ANT) BALUN1.1(UNBAL)
VD33_BUFFERED: C26.1 R6.2 SENSE3.1(VDD)
WLED_CTRL: BT1.40(P0.21) R69.2 T2.1(G)
XC16M3: BT1.38(XC2) C23.1 Y3.1
XC16M4: BT1.37(XC1) C22.1 Y3.3
NetBT1_5: BT1.5(P0.01) R54.2
NetBT1_41: BT1.41(P0.22) BTN1.P3 BTN1.P4
NetIC3_2: IC3.2(GND) LED13.K(CATHODE) T2.3(D)
NetIC3_4: IC3.4(VOUT) L2.1 LED13.A(ANODE)

Not connected (* = marked no-connect by the designer): BT1 2(DCC) 3(P0.30) 16(P0.10) 17(P0.11) 18(P0.12) 19(P0.13) 20(P0.14) 21(P0.15) 22(P0.16) 25(P0.17) 26(P0.18) 27(P0.19) 28(P0.20) 47(P0.28); DEBUG1 6 8 10

### Notes on the sheet
- Vf(typ) must be higher than Vcc - Choose 3.5V bin min!
- (near BT1) Note: SWDCLK Pulldown only for first nRF revision - later versions have them internally

### Library data of the parts
ANT2 = ANTENNA_MONOPOLE1206: 2.45 GHz Antenna; SMD: Yes
BALUN1 = BALUN: 2.45 GHz Impedance Matched Balun-Filter; SMD: Yes
BAT1 = BATTERYBK-912: Coin battery holder; SMD: Yes
BT1 = NRF51822QFN48: Nordic Bluetooth 4.0 low energy modul; SMD: Yes
BTN1 = PUSHBUTTONKMR2XX: Push button; SMD: Yes
C1 C2 C19-C24 C26 C27 C93 C94 = CAP_CERAMIC0402: Ceramic Capacitor; SMD: Yes
C25 C28 C81 = CAP_CERAMIC0603: Ceramic Capacitor; SMD: Yes
DEBUG1 = HEADER-2X5SMD-1.27MM: cortex DEBUG connector
IC3 = ZXLD383SOT23-5: Diodes Inc. boost LED driver; SMD: Yes
L2 = INDUCTOR0805: Inductor; SMD: Yes
LED3 = LED0402: LED common; SMD: Yes
LED6 = LEDMIDLED: LED IR emitter 950NM; SMD: Yes
LED13 = LED3X2: LED common; SMD: Yes
PAD1-PAD10 = HEADER-1X1SMD_MEDIUM: <b>PIN HEADER</b>
R5 R6 R9 R10 R12 R32 R54 R69 = R-EU_0402: RESISTOR; SMD: Yes
SENSE3 = TCS3771: TAOS/ams color/light/proximity sensor; SMD: Yes
T2 = NMOS_ENH: N-Channel MOSFET, enhancement mode; SMD: Yes
X1 = CRYSTAL1206: CL05C120JB5; 1: 1; 2: 2; SMD: Yes
Y3 = CRYSTAL_WITH_GROUND25X20: 16MHz crystal 2.5x2mm; SMD: Yes

## Sheet module 2_ACCEL_GYRO.SchDoc
size 242 x 148 mm
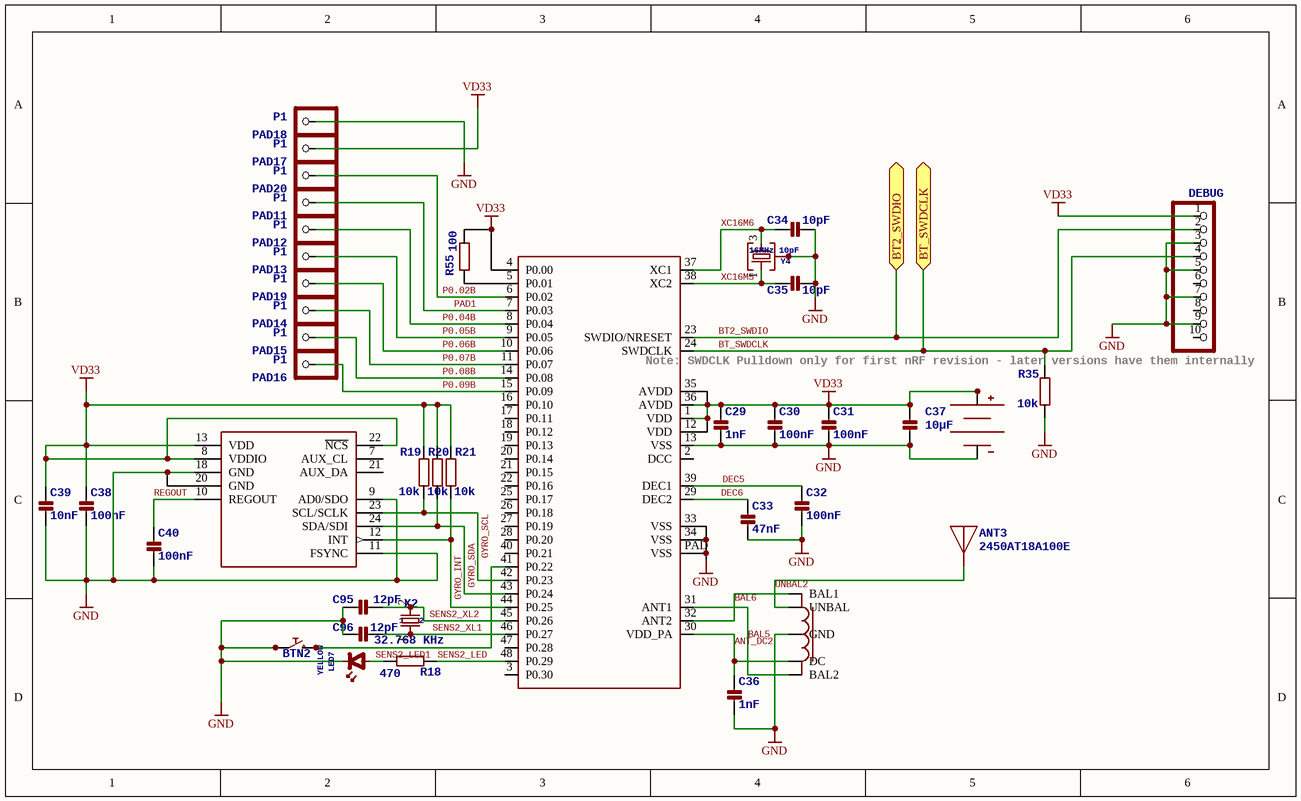
[diagram p6: module 2_ACCEL_GYRO.SchDoc]

### Parts
ANT3  2450AT18A100E  [1206_MINIMELF_COMBO]
BALUN2  2450BM14A0002T  [6-PIN-0603]  (value not drawn)
BAT2  BATTERYBK-912  [BK-912]  (value not drawn)
BT2  NRF51822QFN48  [QFN48_EP]  (value not drawn)
BTN2  Tact Sw 4.6x2.8  [CK-KMR2]  (value not drawn)
C29  1nF  [0402]
C30  100nF  [0402]
C31  100nF  [0402]
C32  100nF  [0402]
C33  47nF  [0402]
C34  10pF  [0402]
C35  10pF  [0402]
C36  1nF  [0402]
C37  10µF  [0603]
C38  100nF  [0402]
C39  10nF  [0402]
C40  100nF  [0402]
C95  12pF  [0402]
C96  12pF  [0402]
DEBUG2  DEBUG  [2X05_SMT]  (no BOM)
LED7  YELLOW  [0402_POLAR]
PAD11  P1  [PCB_MEDIUM_RECT_PAD]  (no BOM)
PAD12  P1  [PCB_MEDIUM_RECT_PAD]  (no BOM)
PAD13  P1  [PCB_MEDIUM_RECT_PAD]  (no BOM)
PAD14  P1  [PCB_MEDIUM_RECT_PAD]  (no BOM)
PAD15  P1  [PCB_MEDIUM_RECT_PAD]  (no BOM)
PAD16  P1  [PCB_MEDIUM_RECT_PAD]  (no BOM)
PAD17  P1  [PCB_MEDIUM_RECT_PAD]  (no BOM)
PAD18  P1  [PCB_MEDIUM_RECT_PAD]  (no BOM)
PAD19  P1  [PCB_MEDIUM_RECT_PAD]  (no BOM)
PAD20  P1  [PCB_MEDIUM_RECT_PAD]  (no BOM)
R18  470  [0402]
R19  10k  [0402]
R20  10k  [0402]
R21  10k  [0402]
R35  10k  [0402]
R55  100  [0402]
SENSE2  MPU6500QFN  [QFN24-0.4]  (value not drawn)
X2  32.768 KHz  [1206_MINIMELF_COMBO]
Y4  16MHz 10pF  [CRYSTAL25X20]

### Ports
BT2_SWDIO, BT_SWDCLK

### Nets
GND: BALUN2.2(GND) BAT2.- BT2.13(VSS) BT2.33(VSS) BT2.34(VSS) BT2.PAD(VSS) BTN2.P1 BTN2.P2 C29.2 C30.2 C31.2 C32.2 C33.2 C34.2 C35.2 C36.2 C37.2(P2) C38.2 C39.2 C40.2 C95.1 C96.1 DEBUG2.3 DEBUG2.5 DEBUG2.7 DEBUG2.9 LED7.K(CATHODE) PAD18.1 R35.1 SENSE2.9(AD0/SDO) SENSE2.11(FSYNC) SENSE2.18(GND) SENSE2.20(GND) Y4.2 Y4.4
VD33: BAT2.+1(+) BAT2.+2(+) BT2.1(VDD) BT2.4(P0.00) BT2.12(VDD) BT2.35(AVDD) BT2.36(AVDD) C29.1 C30.1 C31.1 C37.1(P1) C38.1 C39.1 DEBUG2.1 PAD17.1 R19.2 R20.2 R21.2 R55.1 SENSE2.8(VDDIO) SENSE2.13(VDD) SENSE2.22(~{NCS})
ANT_DC2: BALUN2.5(DC) BT2.30(VDD_PA) C36.1
BAL5: BALUN2.4(BAL2) BT2.31(ANT1)
BAL6: BALUN2.3(BAL1) BT2.32(ANT2)
BT2_SWDIO: BT2.23(SWDIO/NRESET) DEBUG2.2 ; port BT2_SWDIO
BT_SWDCLK: BT2.24(SWDCLK) DEBUG2.4 R35.2 ; port BT_SWDCLK
DEC5: BT2.39(DEC1) C32.1
DEC6: BT2.29(DEC2) C33.1
GYRO_INT: BT2.44(P0.25) R21.1 SENSE2.12(INT)
GYRO_SCL: BT2.42(P0.23) R19.1 SENSE2.23(SCL/SCLK)
GYRO_SDA: BT2.43(P0.24) R20.1 SENSE2.24(SDA/SDI)
P0.02B: BT2.6(P0.02) PAD20.1
P0.04B: BT2.8(P0.04) PAD12.1
P0.05B: BT2.9(P0.05) PAD13.1
P0.06B: BT2.10(P0.06) PAD19.1
P0.07B: BT2.11(P0.07) PAD14.1
P0.08B: BT2.14(P0.08) PAD15.1
P0.09B: BT2.15(P0.09) PAD16.1
PAD1: BT2.7(P0.03) PAD11.1
REGOUT: C40.1 SENSE2.10(REGOUT)
SENS2_LED: BT2.48(P0.29) R18.1
SENS2_LED1: LED7.A(ANODE) R18.2
SENS2_XL1: BT2.46(P0.27) C96.2 X2.1
SENS2_XL2: BT2.45(P0.26) C95.2 X2.2
UNBAL2: ANT3.1(ANT) BALUN2.1(UNBAL)
XC16M5: BT2.38(XC2) C35.1 Y4.1
XC16M6: BT2.37(XC1) C34.1 Y4.3
NetBT2_5: BT2.5(P0.01) R55.2
NetBT2_41: BT2.41(P0.22) BTN2.P3 BTN2.P4

Not connected (* = marked no-connect by the designer): BT2 2(DCC) 3(P0.30) 16(P0.10) 17(P0.11) 18(P0.12) 19(P0.13) 20(P0.14) 21(P0.15) 22(P0.16) 25(P0.17) 26(P0.18) 27(P0.19) 28(P0.20) 40(P0.21) 47(P0.28); DEBUG2 6 8 10; SENSE2 7(AUX_CL) 21(AUX_DA)

### Notes on the sheet
- (near BT2) Note: SWDCLK Pulldown only for first nRF revision - later versions have them internally

### Library data of the parts
ANT3 = ANTENNA_MONOPOLE1206: 2.45 GHz Antenna; SMD: Yes
BALUN2 = BALUN: 2.45 GHz Impedance Matched Balun-Filter; SMD: Yes
BAT2 = BATTERYBK-912: Coin battery holder; SMD: Yes
BT2 = NRF51822QFN48: Nordic Bluetooth 4.0 low energy modul; SMD: Yes
BTN2 = PUSHBUTTONKMR2XX: Push button; SMD: Yes
C29-C36 C38-C40 C95 C96 = CAP_CERAMIC0402: Ceramic Capacitor; SMD: Yes
C37 = CAP_CERAMIC0603: Ceramic Capacitor; SMD: Yes
DEBUG2 = HEADER-2X5SMD-1.27MM: cortex DEBUG connector
LED7 = LED0402: LED common; SMD: Yes
PAD11-PAD20 = HEADER-1X1SMD_MEDIUM: <b>PIN HEADER</b>
R18-R21 R35 R55 = R-EU_0402: RESISTOR; SMD: Yes
SENSE2 = MPU6500QFN: Invensense MPU6500 combined gyro + accelerometer, I2C; SMD: Yes
X2 = CRYSTAL1206: CL05C120JB5; 1: 1; 2: 2; SMD: Yes
Y4 = CRYSTAL_WITH_GROUND25X20: 16MHz crystal 2.5x2mm; SMD: Yes

## Sheet module 3_GROVE.SchDoc
size 280 x 148 mm
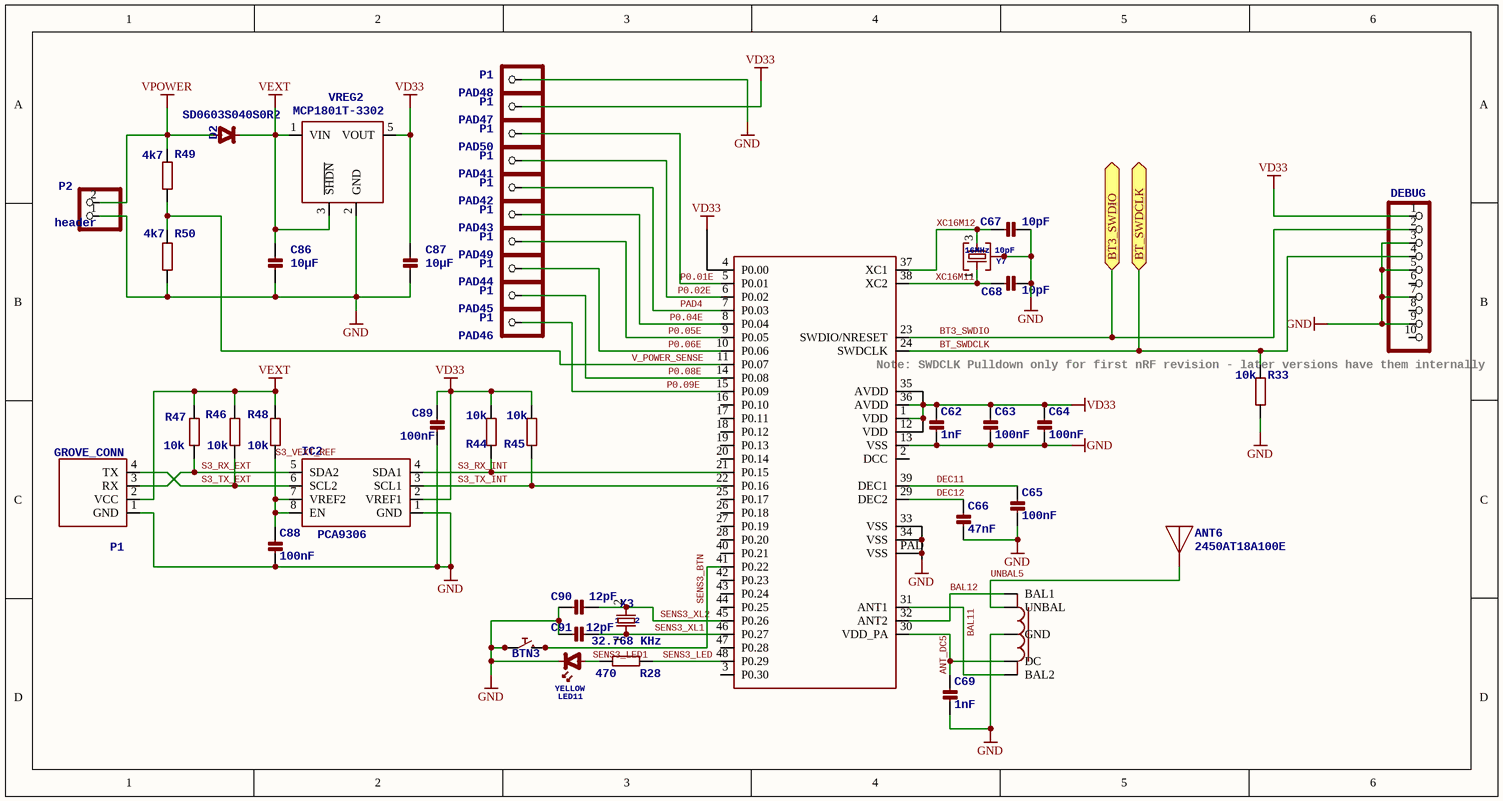
[diagram p7: module 3_GROVE.SchDoc]

### Parts
ANT6  2450AT18A100E  [1206_MINIMELF_COMBO]
BALUN3  2450BM14A0002T  [6-PIN-0603]  (value not drawn)
BT3  NRF51822QFN48  [QFN48_EP]  (value not drawn)
BTN3  Tact Sw 4.6x2.8  [CK-KMR2]  (value not drawn)
C62  1nF  [0402]
C63  100nF  [0402]
C64  100nF  [0402]
C65  100nF  [0402]
C66  47nF  [0402]
C67  10pF  [0402]
C68  10pF  [0402]
C69  1nF  [0402]
C86  10µF  [0603]
C87  10µF  [0603]
C88  100nF  [0402]
C89  100nF  [0402]
C90  12pF  [0402]
C91  12pF  [0402]
D2  SD0603S040S0R2  [0603_POLAR]
DEBUG3  DEBUG  [2X05_SMT]  (no BOM)
IC2  PCA9306  [US8]
LED11  YELLOW  [0402_POLAR]
P1  GROVE_CONN  [GROVE-CONN-TH]
P2  header  [1X02_ROUND]  (no BOM)
PAD41  P1  [PCB_MEDIUM_RECT_PAD]  (no BOM)
PAD42  P1  [PCB_MEDIUM_RECT_PAD]  (no BOM)
PAD43  P1  [PCB_MEDIUM_RECT_PAD]  (no BOM)
PAD44  P1  [PCB_MEDIUM_RECT_PAD]  (no BOM)
PAD45  P1  [PCB_MEDIUM_RECT_PAD]  (no BOM)
PAD46  P1  [PCB_MEDIUM_RECT_PAD]  (no BOM)
PAD47  P1  [PCB_MEDIUM_RECT_PAD]  (no BOM)
PAD48  P1  [PCB_MEDIUM_RECT_PAD]  (no BOM)
PAD49  P1  [PCB_MEDIUM_RECT_PAD]  (no BOM)
PAD50  P1  [PCB_MEDIUM_RECT_PAD]  (no BOM)
R28  470  [0402]
R33  10k  [0402]
R44  10k  [0402]
R45  10k  [0402]
R46  10k  [0402]
R47  10k  [0402]
R48  10k  [0402]
R49  4k7  [0402]
R50  4k7  [0402]
VREG2  MCP1801T-3302  [SOT-23-5]
X3  32.768 KHz  [1206_MINIMELF_COMBO]
Y7  16MHz 10pF  [CRYSTAL25X20]

### Ports
BT3_SWDIO, BT_SWDCLK

### Nets
GND: BALUN3.2(GND) BT3.13(VSS) BT3.33(VSS) BT3.34(VSS) BT3.PAD(VSS) BTN3.P1 BTN3.P2 C62.2 C63.2 C64.2 C65.2 C66.2 C67.2 C68.2 C69.2 C86.2(P2) C87.2(P2) C88.2 C89.2 C90.1 C91.1 DEBUG3.3 DEBUG3.5 DEBUG3.7 DEBUG3.9 IC2.1(GND) LED11.K(CATHODE) P1.1(GND) P2.1 PAD48.1 R33.1 R50.1 VREG2.2(GND) Y7.2 Y7.4
VD33: BT3.1(VDD) BT3.4(P0.00) BT3.12(VDD) BT3.35(AVDD) BT3.36(AVDD) C62.1 C63.1 C64.1 C87.1(P1) C89.1 DEBUG3.1 IC2.2(VREF1) PAD47.1 R44.2 R45.2 VREG2.5(VOUT)
VEXT: C86.1(P1) D2.K(CATHODE) P1.2(VCC) R46.2 R47.2 R48.2 VREG2.1(VIN) VREG2.3(~{SHDN})
VPOWER: D2.A(ANODE) P2.2 R49.2
ANT_DC5: BALUN3.5(DC) BT3.30(VDD_PA) C69.1
BAL11: BALUN3.4(BAL2) BT3.31(ANT1)
BAL12: BALUN3.3(BAL1) BT3.32(ANT2)
BT3_SWDIO: BT3.23(SWDIO/NRESET) DEBUG3.2 ; port BT3_SWDIO
BT_SWDCLK: BT3.24(SWDCLK) DEBUG3.4 R33.2 ; port BT_SWDCLK
DEC11: BT3.39(DEC1) C65.1
DEC12: BT3.29(DEC2) C66.1
P0.01E: BT3.5(P0.01) PAD50.1
P0.02E: BT3.6(P0.02) PAD41.1
P0.04E: BT3.8(P0.04) PAD43.1
P0.05E: BT3.9(P0.05) PAD49.1
P0.06E: BT3.10(P0.06) PAD44.1
P0.08E: BT3.14(P0.08) PAD45.1
P0.09E: BT3.15(P0.09) PAD46.1
PAD4: BT3.7(P0.03) PAD42.1
S3_RX_EXT: IC2.5(SDA2) P1.3(RX) R47.1
S3_RX_INT: BT3.21(P0.15) IC2.4(SDA1) R44.1
S3_TX_EXT: IC2.6(SCL2) P1.4(TX) R46.1
S3_TX_INT: BT3.22(P0.16) IC2.3(SCL1) R45.1
S3_VEXT_REF: C88.1 IC2.7(VREF2) IC2.8(EN) R48.1
SENS3_BTN: BT3.41(P0.22) BTN3.P3 BTN3.P4
SENS3_LED: BT3.48(P0.29) R28.1
SENS3_LED1: LED11.A(ANODE) R28.2
SENS3_XL1: BT3.46(P0.27) C91.2 X3.1
SENS3_XL2: BT3.45(P0.26) C90.2 X3.2
UNBAL5: ANT6.1(ANT) BALUN3.1(UNBAL)
V_POWER_SENSE: BT3.11(P0.07) R49.1 R50.2
XC16M11: BT3.38(XC2) C68.1 Y7.1
XC16M12: BT3.37(XC1) C67.1 Y7.3

Not connected (* = marked no-connect by the designer): BT3 2(DCC) 3(P0.30) 16(P0.10) 17(P0.11) 18(P0.12) 19(P0.13) 20(P0.14) 25(P0.17) 26(P0.18) 27(P0.19) 28(P0.20) 40(P0.21) 42(P0.23) 43(P0.24) 44(P0.25) 47(P0.28); DEBUG3 6 8 10

### Notes on the sheet
- (near BT3) Note: SWDCLK Pulldown only for first nRF revision - later versions have them internally

### Library data of the parts
ANT6 = ANTENNA_MONOPOLE1206: 2.45 GHz Antenna; SMD: Yes
BALUN3 = BALUN: 2.45 GHz Impedance Matched Balun-Filter; SMD: Yes
BT3 = NRF51822QFN48: Nordic Bluetooth 4.0 low energy modul; SMD: Yes
BTN3 = PUSHBUTTONKMR2XX: Push button; SMD: Yes
C62-C69 C88-C91 = CAP_CERAMIC0402: Ceramic Capacitor; SMD: Yes
C86 C87 = CAP_CERAMIC0603: Ceramic Capacitor; SMD: Yes
D2 = DIODE0603: Shottky diode 40V 0.2A; SMD: Yes
DEBUG3 = HEADER-2X5SMD-1.27MM: cortex DEBUG connector
IC2 = PCA9306US8: I2C bidirectional level translator; SMD: Yes
LED11 = LED0402: LED common; SMD: Yes
P1 = GROVE_CONNV: Seeed Grove 4-pin 2mm connector; SMD: No
P2 = HEADER-1X2ROUND: PIN HEADER; SMD: No
PAD41-PAD50 = HEADER-1X1SMD_MEDIUM: <b>PIN HEADER</b>
R28 R33 R44-R50 = R-EU_0402: RESISTOR; SMD: Yes
VREG2 = MCP180XSOT-23-5: Microchip LDO; SMD: Yes
X3 = CRYSTAL1206: CL05C120JB5; 1: 1; 2: 2; SMD: Yes
Y7 = CRYSTAL_WITH_GROUND25X20: 16MHz crystal 2.5x2mm; SMD: Yes

## Sheet module 4_TEMP_HUMIDITY.SchDoc
size 228 x 148 mm
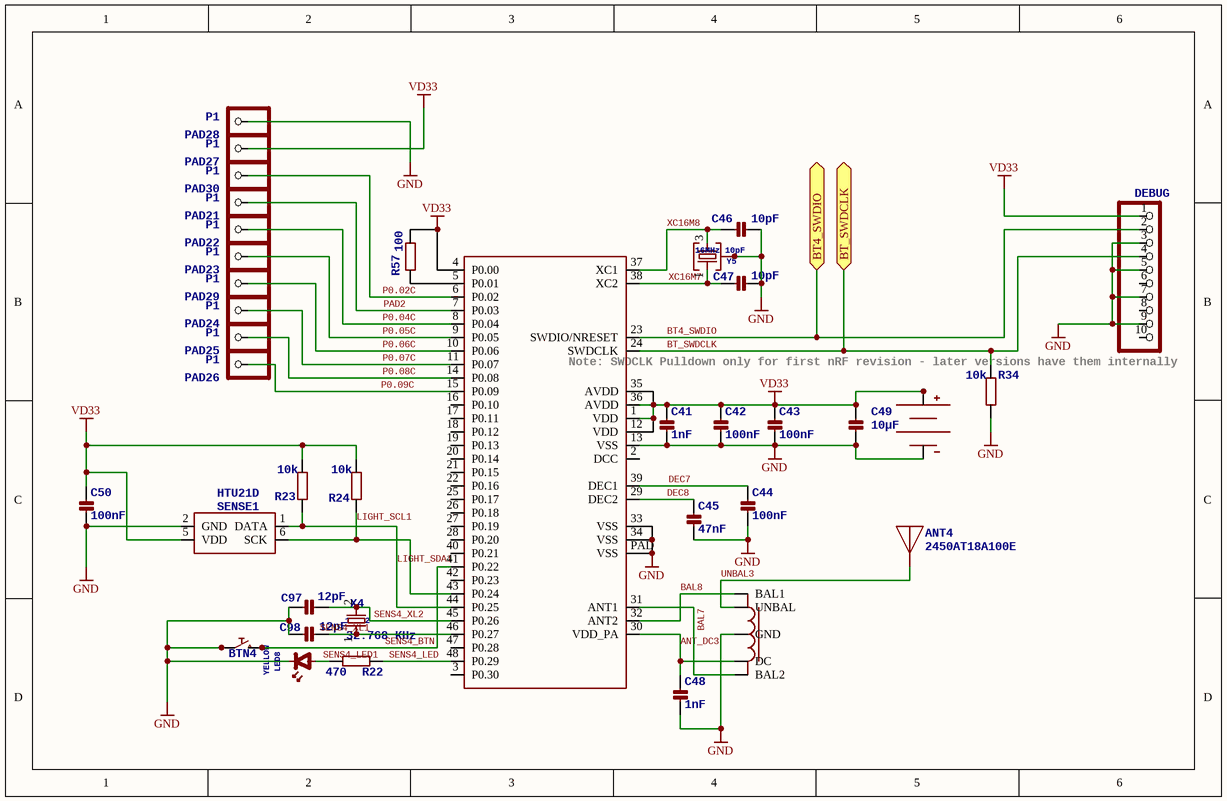
[diagram p8: module 4_TEMP_HUMIDITY.SchDoc]

### Parts
ANT4  2450AT18A100E  [1206_MINIMELF_COMBO]
BALUN4  2450BM14A0002T  [6-PIN-0603]  (value not drawn)
BAT4  BATTERYBK-912  [BK-912]  (value not drawn)
BT4  NRF51822QFN48  [QFN48_EP]  (value not drawn)
BTN4  Tact Sw 4.6x2.8  [CK-KMR2]  (value not drawn)
C41  1nF  [0402]
C42  100nF  [0402]
C43  100nF  [0402]
C44  100nF  [0402]
C45  47nF  [0402]
C46  10pF  [0402]
C47  10pF  [0402]
C48  1nF  [0402]
C49  10µF  [0603]
C50  100nF  [0402]
C97  12pF  [0402]
C98  12pF  [0402]
DEBUG4  DEBUG  [2X05_SMT]  (no BOM)
LED8  YELLOW  [0402_POLAR]
PAD21  P1  [PCB_MEDIUM_RECT_PAD]  (no BOM)
PAD22  P1  [PCB_MEDIUM_RECT_PAD]  (no BOM)
PAD23  P1  [PCB_MEDIUM_RECT_PAD]  (no BOM)
PAD24  P1  [PCB_MEDIUM_RECT_PAD]  (no BOM)
PAD25  P1  [PCB_MEDIUM_RECT_PAD]  (no BOM)
PAD26  P1  [PCB_MEDIUM_RECT_PAD]  (no BOM)
PAD27  P1  [PCB_MEDIUM_RECT_PAD]  (no BOM)
PAD28  P1  [PCB_MEDIUM_RECT_PAD]  (no BOM)
PAD29  P1  [PCB_MEDIUM_RECT_PAD]  (no BOM)
PAD30  P1  [PCB_MEDIUM_RECT_PAD]  (no BOM)
R22  470  [0402]
R23  10k  [0402]
R24  10k  [0402]
R34  10k  [0402]
R57  100  [0402]
SENSE1  HTU21D  [HTU21D]
X4  32.768 KHz  [1206_MINIMELF_COMBO]
Y5  16MHz 10pF  [CRYSTAL25X20]

### Ports
BT4_SWDIO, BT_SWDCLK

### Nets
GND: BALUN4.2(GND) BAT4.- BT4.13(VSS) BT4.33(VSS) BT4.34(VSS) BT4.PAD(VSS) BTN4.P1 BTN4.P2 C41.2 C42.2 C43.2 C44.2 C45.2 C46.2 C47.2 C48.2 C49.2(P2) C50.2 C97.1 C98.1 DEBUG4.3 DEBUG4.5 DEBUG4.7 DEBUG4.9 LED8.K(CATHODE) PAD28.1 R34.1 SENSE1.2(GND) Y5.2 Y5.4
VD33: BAT4.+1(+) BAT4.+2(+) BT4.1(VDD) BT4.4(P0.00) BT4.12(VDD) BT4.35(AVDD) BT4.36(AVDD) C41.1 C42.1 C43.1 C49.1(P1) C50.1 DEBUG4.1 PAD27.1 R23.2 R24.2 R57.1 SENSE1.5(VDD)
ANT_DC3: BALUN4.5(DC) BT4.30(VDD_PA) C48.1
BAL7: BALUN4.4(BAL2) BT4.31(ANT1)
BAL8: BALUN4.3(BAL1) BT4.32(ANT2)
BT4_SWDIO: BT4.23(SWDIO/NRESET) DEBUG4.2 ; port BT4_SWDIO
BT_SWDCLK: BT4.24(SWDCLK) DEBUG4.4 R34.2 ; port BT_SWDCLK
DEC7: BT4.39(DEC1) C44.1
DEC8: BT4.29(DEC2) C45.1
LIGHT_SCL1: BT4.43(P0.24) R24.1 SENSE1.6(SCK)
LIGHT_SDA1: BT4.44(P0.25) R23.1 SENSE1.1(DATA)
P0.02C: BT4.6(P0.02) PAD30.1
P0.04C: BT4.8(P0.04) PAD22.1
P0.05C: BT4.9(P0.05) PAD23.1
P0.06C: BT4.10(P0.06) PAD29.1
P0.07C: BT4.11(P0.07) PAD24.1
P0.08C: BT4.14(P0.08) PAD25.1
P0.09C: BT4.15(P0.09) PAD26.1
PAD2: BT4.7(P0.03) PAD21.1
SENS4_BTN: BT4.41(P0.22) BTN4.P3 BTN4.P4
SENS4_LED: BT4.48(P0.29) R22.1
SENS4_LED1: LED8.A(ANODE) R22.2
SENS4_XL2: BT4.45(P0.26) C97.2 X4.2
UNBAL3: ANT4.1(ANT) BALUN4.1(UNBAL)
XC16M7: BT4.38(XC2) C47.1 Y5.1
XC16M8: BT4.37(XC1) C46.1 Y5.3
NetBT4_5: BT4.5(P0.01) R57.2
NetBT4_46: BT4.46(P0.27) C98.2 X4.1

Not connected (* = marked no-connect by the designer): BT4 2(DCC) 3(P0.30) 16(P0.10) 17(P0.11) 18(P0.12) 19(P0.13) 20(P0.14) 21(P0.15) 22(P0.16) 25(P0.17) 26(P0.18) 27(P0.19) 28(P0.20) 40(P0.21) 42(P0.23) 47(P0.28); DEBUG4 6 8 10

### Notes on the sheet
- (near BT4) Note: SWDCLK Pulldown only for first nRF revision - later versions have them internally
- Labels drawn without touching a wire or pin: SENS4_XL1

### Library data of the parts
ANT4 = ANTENNA_MONOPOLE1206: 2.45 GHz Antenna; SMD: Yes
BALUN4 = BALUN: 2.45 GHz Impedance Matched Balun-Filter; SMD: Yes
BAT4 = BATTERYBK-912: Coin battery holder; SMD: Yes
BT4 = NRF51822QFN48: Nordic Bluetooth 4.0 low energy modul; SMD: Yes
BTN4 = PUSHBUTTONKMR2XX: Push button; SMD: Yes
C41-C48 C50 C97 C98 = CAP_CERAMIC0402: Ceramic Capacitor; SMD: Yes
C49 = CAP_CERAMIC0603: Ceramic Capacitor; SMD: Yes
DEBUG4 = HEADER-2X5SMD-1.27MM: cortex DEBUG connector
LED8 = LED0402: LED common; SMD: Yes
PAD21-PAD30 = HEADER-1X1SMD_MEDIUM: <b>PIN HEADER</b>
R22-R24 R34 R57 = R-EU_0402: RESISTOR; SMD: Yes
SENSE1 = HTU21D: Humidity and temperature sensor; SMD: Yes
X4 = CRYSTAL1206: CL05C120JB5; 1: 1; 2: 2; SMD: Yes
Y5 = CRYSTAL_WITH_GROUND25X20: 16MHz crystal 2.5x2mm; SMD: Yes

## Sheet module 5_IR TRANSMITTER.SchDoc
size 242 x 148 mm
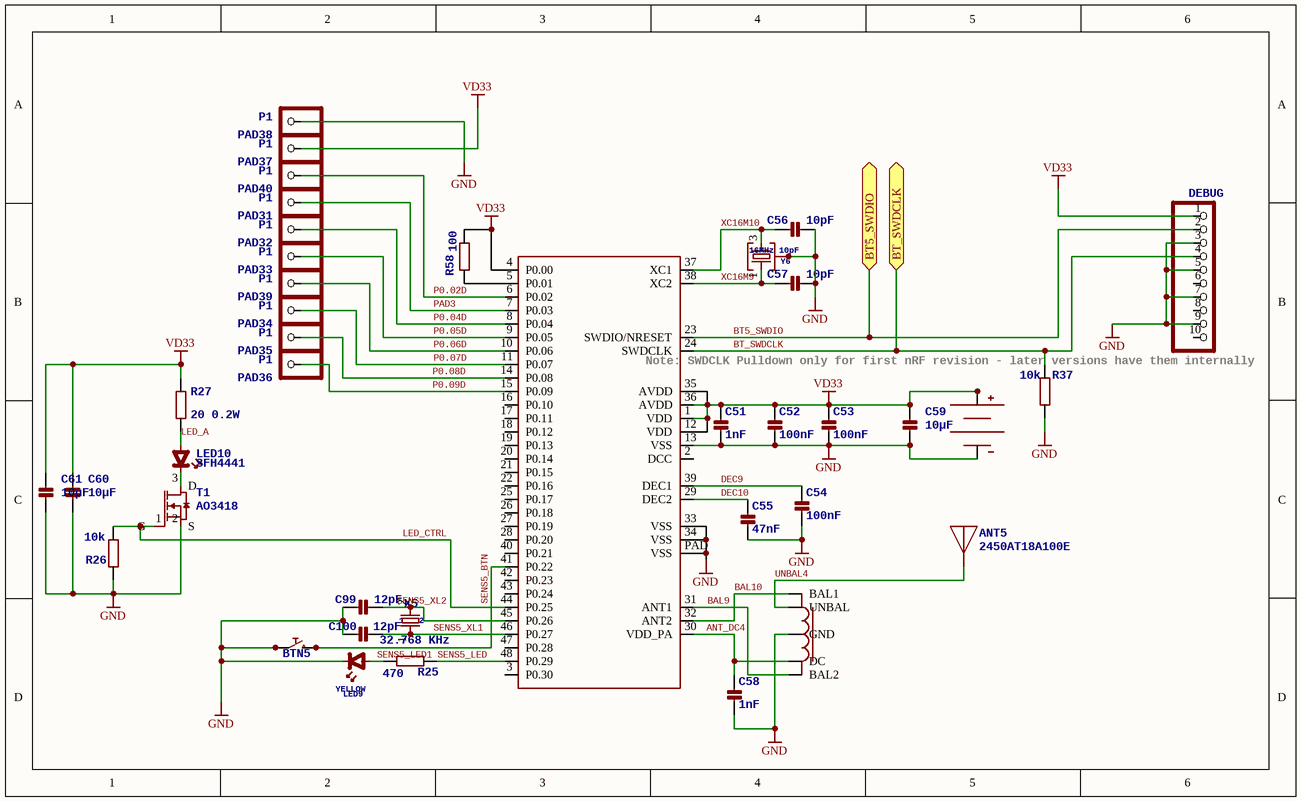
[diagram p9: module 5_IR TRANSMITTER.SchDoc]

### Parts
ANT5  2450AT18A100E  [1206_MINIMELF_COMBO]
BALUN5  2450BM14A0002T  [6-PIN-0603]  (value not drawn)
BAT5  BATTERYBK-912  [BK-912]  (value not drawn)
BT5  NRF51822QFN48  [QFN48_EP]  (value not drawn)
BTN5  Tact Sw 4.6x2.8  [CK-KMR2]  (value not drawn)
C51  1nF  [0402]
C52  100nF  [0402]
C53  100nF  [0402]
C54  100nF  [0402]
C55  47nF  [0402]
C56  10pF  [0402]
C57  10pF  [0402]
C58  1nF  [0402]
C59  10µF  [0603]
C60  10µF  [0603]
C61  10µF  [0603]
C99  12pF  [0402]
C100  12pF  [0402]
DEBUG5  DEBUG  [2X05_SMT]  (no BOM)
LED9  YELLOW  [0402_POLAR]
LED10  SFH4441  [MIDLED]
PAD31  P1  [PCB_MEDIUM_RECT_PAD]  (no BOM)
PAD32  P1  [PCB_MEDIUM_RECT_PAD]  (no BOM)
PAD33  P1  [PCB_MEDIUM_RECT_PAD]  (no BOM)
PAD34  P1  [PCB_MEDIUM_RECT_PAD]  (no BOM)
PAD35  P1  [PCB_MEDIUM_RECT_PAD]  (no BOM)
PAD36  P1  [PCB_MEDIUM_RECT_PAD]  (no BOM)
PAD37  P1  [PCB_MEDIUM_RECT_PAD]  (no BOM)
PAD38  P1  [PCB_MEDIUM_RECT_PAD]  (no BOM)
PAD39  P1  [PCB_MEDIUM_RECT_PAD]  (no BOM)
PAD40  P1  [PCB_MEDIUM_RECT_PAD]  (no BOM)
R25  470  [0402]
R26  10k  [0402]
R27  20 0.2W  [1206_MINIMELF_COMBO]
R37  10k  [0402]
R58  100  [0402]
T1  AO3418  [SOT23]
X5  32.768 KHz  [1206_MINIMELF_COMBO]
Y6  16MHz 10pF  [CRYSTAL25X20]

### Ports
BT5_SWDIO, BT_SWDCLK

### Nets
GND: BALUN5.2(GND) BAT5.- BT5.13(VSS) BT5.33(VSS) BT5.34(VSS) BT5.PAD(VSS) BTN5.P1 BTN5.P2 C51.2 C52.2 C53.2 C54.2 C55.2 C56.2 C57.2 C58.2 C59.2(P2) C60.2(P2) C61.2(P2) C99.1 C100.1 DEBUG5.3 DEBUG5.5 DEBUG5.7 DEBUG5.9 LED9.K(CATHODE) PAD38.1 R26.1 R37.1 T1.2(S) Y6.2 Y6.4
VD33: BAT5.+1(+) BAT5.+2(+) BT5.1(VDD) BT5.4(P0.00) BT5.12(VDD) BT5.35(AVDD) BT5.36(AVDD) C51.1 C52.1 C53.1 C59.1(P1) C60.1(P1) C61.1(P1) DEBUG5.1 PAD37.1 R27.2 R58.1
ANT_DC4: BALUN5.5(DC) BT5.30(VDD_PA) C58.1
BAL9: BALUN5.4(BAL2) BT5.31(ANT1)
BAL10: BALUN5.3(BAL1) BT5.32(ANT2)
BT5_SWDIO: BT5.23(SWDIO/NRESET) DEBUG5.2 ; port BT5_SWDIO
BT_SWDCLK: BT5.24(SWDCLK) DEBUG5.4 R37.2 ; port BT_SWDCLK
DEC9: BT5.39(DEC1) C54.1
DEC10: BT5.29(DEC2) C55.1
LED_A: LED10.A(ANODE) R27.1
LED_CTRL: BT5.44(P0.25) R26.2 T1.1(G)
P0.02D: BT5.6(P0.02) PAD40.1
P0.04D: BT5.8(P0.04) PAD32.1
P0.05D: BT5.9(P0.05) PAD33.1
P0.06D: BT5.10(P0.06) PAD39.1
P0.07D: BT5.11(P0.07) PAD34.1
P0.08D: BT5.14(P0.08) PAD35.1
P0.09D: BT5.15(P0.09) PAD36.1
PAD3: BT5.7(P0.03) PAD31.1
SENS5_BTN: BT5.41(P0.22) BTN5.P3 BTN5.P4
SENS5_LED: BT5.48(P0.29) R25.1
SENS5_LED1: LED9.A(ANODE) R25.2
SENS5_XL1: BT5.46(P0.27) C100.2 X5.1
SENS5_XL2: BT5.45(P0.26) C99.2 X5.2
UNBAL4: ANT5.1(ANT) BALUN5.1(UNBAL)
XC16M9: BT5.38(XC2) C57.1 Y6.1
XC16M10: BT5.37(XC1) C56.1 Y6.3
NetBT5_5: BT5.5(P0.01) R58.2
NetLED10_C: LED10.C(CATHODE) T1.3(D)

Not connected (* = marked no-connect by the designer): BT5 2(DCC) 3(P0.30) 16(P0.10) 17(P0.11) 18(P0.12) 19(P0.13) 20(P0.14) 21(P0.15) 22(P0.16) 25(P0.17) 26(P0.18) 27(P0.19) 28(P0.20) 40(P0.21) 42(P0.23) 43(P0.24) 47(P0.28); DEBUG5 6 8 10

### Notes on the sheet
- (near BT5) Note: SWDCLK Pulldown only for first nRF revision - later versions have them internally

### Library data of the parts
ANT5 = ANTENNA_MONOPOLE1206: 2.45 GHz Antenna; SMD: Yes
BALUN5 = BALUN: 2.45 GHz Impedance Matched Balun-Filter; SMD: Yes
BAT5 = BATTERYBK-912: Coin battery holder; SMD: Yes
BT5 = NRF51822QFN48: Nordic Bluetooth 4.0 low energy modul; SMD: Yes
BTN5 = PUSHBUTTONKMR2XX: Push button; SMD: Yes
C51-C58 C99 C100 = CAP_CERAMIC0402: Ceramic Capacitor; SMD: Yes
C59-C61 = CAP_CERAMIC0603: Ceramic Capacitor; SMD: Yes
DEBUG5 = HEADER-2X5SMD-1.27MM: cortex DEBUG connector
LED9 = LED0402: LED common; SMD: Yes
LED10 = LEDMIDLED: LED common; SMD: Yes
PAD31-PAD40 = HEADER-1X1SMD_MEDIUM: <b>PIN HEADER</b>
R25 R26 R37 R58 = R-EU_0402: RESISTOR; SMD: Yes
R27 = R-EU_1206_MINIMELF_COMBO: RESISTOR; SMD: Yes
T1 = NMOS_ENH: N-Channel MOSFET, enhancement mode; SMD: Yes
X5 = CRYSTAL1206: CL05C120JB5; 1: 1; 2: 2; SMD: Yes
Y6 = CRYSTAL_WITH_GROUND25X20: 16MHz crystal 2.5x2mm; SMD: Yes

## Sheet module 6_MIC.SchDoc
size A4
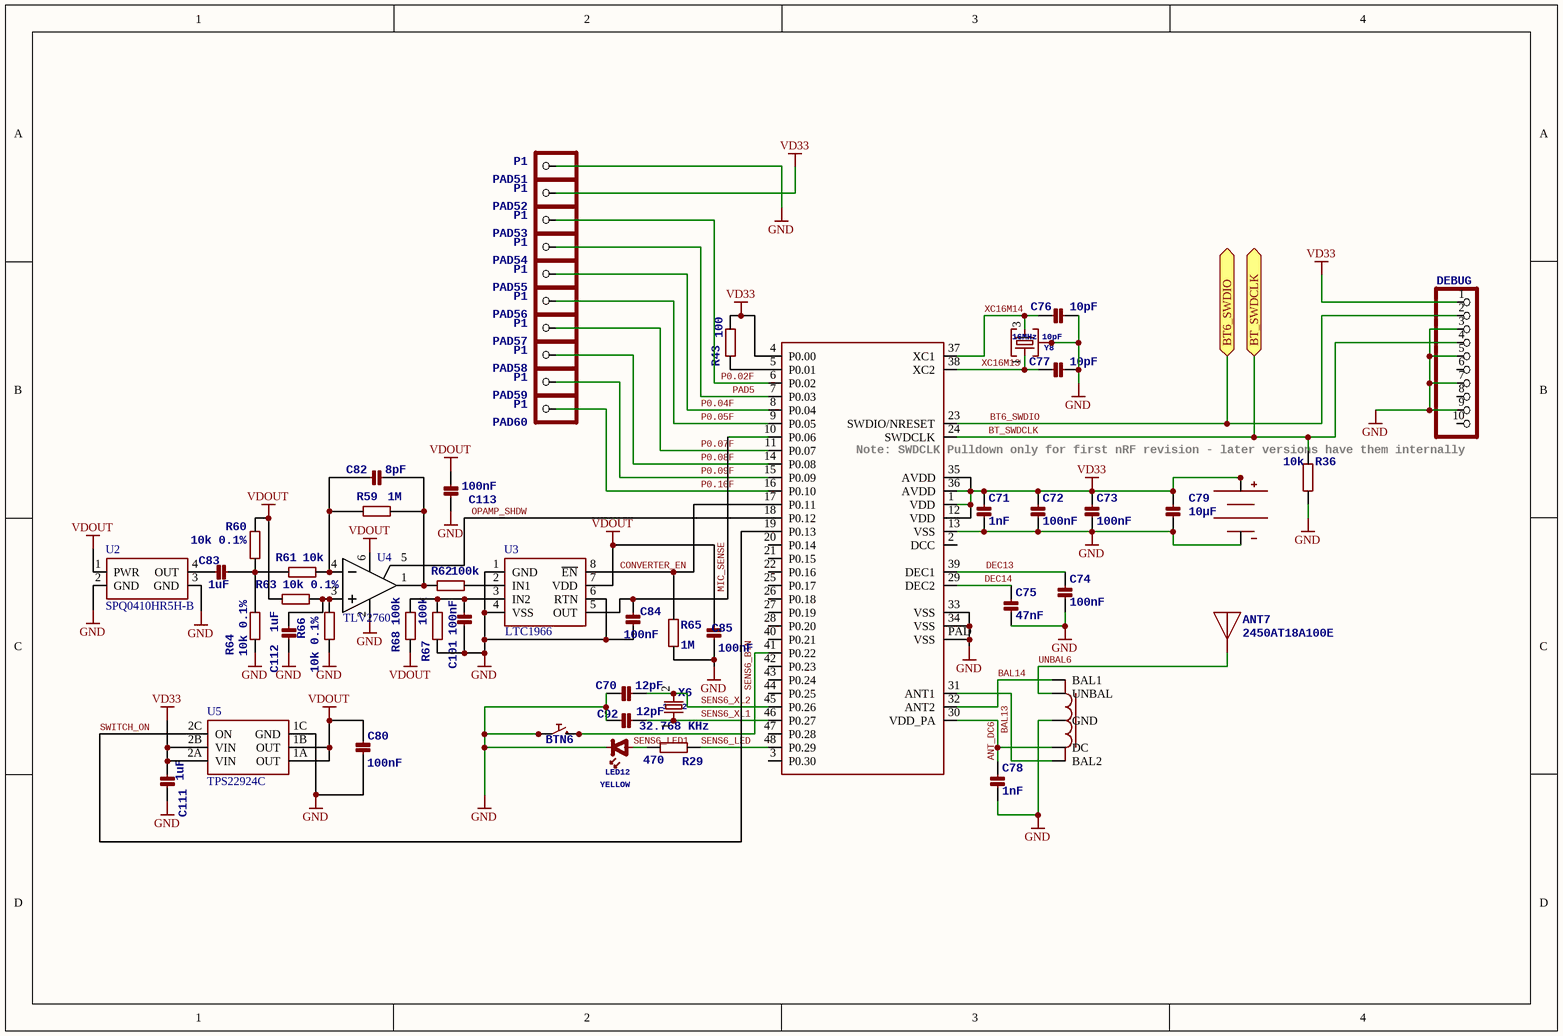
[diagram p10: module 6_MIC.SchDoc]

### Parts
ANT7  2450AT18A100E  [1206_MINIMELF_COMBO]
BALUN6  2450BM14A0002T  [6-PIN-0603]  (value not drawn)
BAT3  BATTERYBK-912  [BK-912]  (value not drawn)
BT6  NRF51822QFN48  [QFN48_EP]  (value not drawn)
BTN6  Tact Sw 4.6x2.8  [CK-KMR2]  (value not drawn)
C70  12pF  [0402]
C71  1nF  [0402]
C72  100nF  [0402]
C73  100nF  [0402]
C74  100nF  [0402]
C75  47nF  [0402]
C76  10pF  [0402]
C77  10pF  [0402]
C78  1nF  [0402]
C79  10µF  [0603]
C80  100nF  [0402]
C82  8pF  [0402]
C83  1uF  [0402]
C84  100nF  [0402]
C85  100nF  [0402]
C92  12pF  [0402]
C101  100nF  [0402]
C111  1uF  [0402]
C112  1uF  [0402]
C113  100nF  [0402]
DEBUG6  DEBUG  [2X05_SMT]  (no BOM)
LED12  YELLOW  [0402_POLAR]
PAD51  P1  [PCB_MEDIUM_RECT_PAD]  (no BOM)
PAD52  P1  [PCB_MEDIUM_RECT_PAD]  (no BOM)
PAD53  P1  [PCB_MEDIUM_RECT_PAD]  (no BOM)
PAD54  P1  [PCB_MEDIUM_RECT_PAD]  (no BOM)
PAD55  P1  [PCB_MEDIUM_RECT_PAD]  (no BOM)
PAD56  P1  [PCB_MEDIUM_RECT_PAD]  (no BOM)
PAD57  P1  [PCB_MEDIUM_RECT_PAD]  (no BOM)
PAD58  P1  [PCB_MEDIUM_RECT_PAD]  (no BOM)
PAD59  P1  [PCB_MEDIUM_RECT_PAD]  (no BOM)
PAD60  P1  [PCB_MEDIUM_RECT_PAD]  (no BOM)
R29  470  [0402]
R36  10k  [0402]
R43  100  [0402]
R59  1M  [0603]
R60  10k 0.1%  [0402]
R61  10k  [0603]
R62  100k  [0402]
R63  10k 0.1%  [0402]
R64  10k 0.1%  [0402]
R65  1M  [0402]
R66  10k 0.1%  [0402]
R67  100k  [0402]
R68  100k  [0402]
U2  SPQ0410HR5H-B  [SPQ0410HR5H-B]
U3  LTC1966  [MSOP-8]
U4  TLV2760  [DBV-6]
U5  TPS22924C  [YZP-6]
X6  32.768 KHz  [1206_MINIMELF_COMBO]
Y8  16MHz 10pF  [CRYSTAL25X20]

### Ports
BT6_SWDIO, BT_SWDCLK

### Nets
GND: BALUN6.2(GND) BAT3.- BT6.13(VSS) BT6.33(VSS) BT6.34(VSS) BT6.PAD(VSS) BTN6.P1 BTN6.P2 C70.1 C71.2 C72.2 C73.2 C74.2 C75.2 C76.2 C77.2 C78.2 C79.2(P2) C80.1 C84.1 C85.1 C92.1 C101.1 C111.2 C112.1 C113.1 DEBUG6.3 DEBUG6.5 DEBUG6.7 DEBUG6.9 LED12.K(CATHODE) PAD51.1 R36.1 R64.2 R65.2 R66.1 R67.1 U2.2(GND) U2.3(GND) U3.1(GND) U3.4(VSS) U3.6(RTN) U4.2(GND) U5.1C(GND) Y8.2 Y8.4
VD33: BAT3.+1(+) BAT3.+2(+) BT6.1(VDD) BT6.4(P0.00) BT6.12(VDD) BT6.35(AVDD) BT6.36(AVDD) C71.1 C72.1 C73.1 C79.1(P1) C111.1 DEBUG6.1 PAD52.1 R43.1 U5.2A(VIN) U5.2B(VIN)
VDOUT: C80.2 C85.2 C113.2 R60.1 R63.1 R68.1 U2.1(PWR) U3.7(VDD) U4.6(V+) U5.1A(OUT) U5.1B(OUT)
ANT_DC6: BALUN6.5(DC) BT6.30(VDD_PA) C78.1
BAL13: BALUN6.4(BAL2) BT6.31(ANT1)
BAL14: BALUN6.3(BAL1) BT6.32(ANT2)
BT6_SWDIO: BT6.23(SWDIO/NRESET) DEBUG6.2 ; port BT6_SWDIO
BT_SWDCLK: BT6.24(SWDCLK) DEBUG6.4 R36.2 ; port BT_SWDCLK
CONVERTER_EN: BT6.17(P0.11) R65.1 U3.8(~{EN})
DEC13: BT6.39(DEC1) C74.1
DEC14: BT6.29(DEC2) C75.1
MIC_SENSE: BT6.10(P0.06) C84.2 U3.5(OUT)
OPAMP_SHDW: BT6.18(P0.12) U4.5(~{SHD})
P0.02F: BT6.6(P0.02) PAD53.1
P0.04F: BT6.8(P0.04) PAD55.1
P0.05F: BT6.9(P0.05) PAD56.1
P0.07F: BT6.11(P0.07) PAD57.1
P0.08F: BT6.14(P0.08) PAD58.1
P0.09F: BT6.15(P0.09) PAD59.1
P0.10F: BT6.16(P0.10) PAD60.1
PAD5: BT6.7(P0.03) PAD54.1
SENS6_BTN: BT6.41(P0.22) BTN6.P3 BTN6.P4
SENS6_LED: BT6.48(P0.29) R29.1
SENS6_LED1: LED12.A(ANODE) R29.2
SENS6_XL1: BT6.46(P0.27) C92.2 X6.1
SENS6_XL2: BT6.45(P0.26) C70.2 X6.2
SWITCH_ON: BT6.19(P0.13) U5.2C(ON)
UNBAL6: ANT7.1(ANT) BALUN6.1(UNBAL)
XC16M13: BT6.38(XC2) C77.1 Y8.1
XC16M14: BT6.37(XC1) C76.1 Y8.3
NetBT6_5: BT6.5(P0.01) R43.2
NetC82_1: C82.1 R59.1 R61.2 U4.4(IN-)
NetC82_2: C82.2 R59.2 R62.1 U4.1(OUT)
NetC83_1: C83.1 R60.2 R61.1 R64.1
NetC83_2: C83.2 U2.4(OUT)
NetC101_2: C101.2 R67.2 R68.2 U3.3(IN2)
NetC112_2: C112.2 R63.2 R66.2 U4.3(IN+)
NetR62_2: R62.2 U3.2(IN1)

Not connected (* = marked no-connect by the designer): BT6 2(DCC) 3(P0.30) 20(P0.14) 21(P0.15) 22(P0.16) 25(P0.17) 26(P0.18) 27(P0.19) 28(P0.20) 40(P0.21) 42(P0.23) 43(P0.24) 44(P0.25) 47(P0.28); DEBUG6 6 8 10

### Notes on the sheet
- (near BT6) Note: SWDCLK Pulldown only for first nRF revision - later versions have them internally

### Library data of the parts
ANT7 = ANTENNA_MONOPOLE1206: 2.45 GHz Antenna; SMD: Yes
BALUN6 = BALUN: 2.45 GHz Impedance Matched Balun-Filter; SMD: Yes
BAT3 = BATTERYBK-912: Coin battery holder; SMD: Yes
BT6 = NRF51822QFN48: Nordic Bluetooth 4.0 low energy modul; SMD: Yes
BTN6 = PUSHBUTTONKMR2XX: Push button; SMD: Yes
C70-C78 C80 C82-C85 C92 C101 C111-C113 = CAP_CERAMIC0402: Ceramic Capacitors; SMD: Yes
C79 = CAP_CERAMIC0603: Ceramic Capacitor; SMD: Yes
DEBUG6 = HEADER-2X5SMD-1.27MM: cortex DEBUG connector
LED12 = LED0402: LED common; SMD: Yes
PAD51-PAD60 = HEADER-1X1SMD_MEDIUM: <b>PIN HEADER</b>
R29 R36 R43 R59-R68 = R-EU_0402: <B>RESISTOR</B>, European symbol; SMD: Yes
U2 = SPU0410HR5H-PB: SPQ0410HR5H-B mic; SMD: Yes
U3 = LTC1966: RMS-to-DC converter; SMD: Yes
U4 = TLV2760: TI OP-AMP; SMD: Yes
U5 = TPS22963: LOAD SWITCH; SMD: Yes
X6 = CRYSTAL1206: CL05C120JB5; 1: 1; 2: 2; SMD: Yes
Y8 = CRYSTAL_WITH_GROUND25X20: 16MHz crystal 2.5x2mm; SMD: Yes

## Sheet power_main.SchDoc
size A4
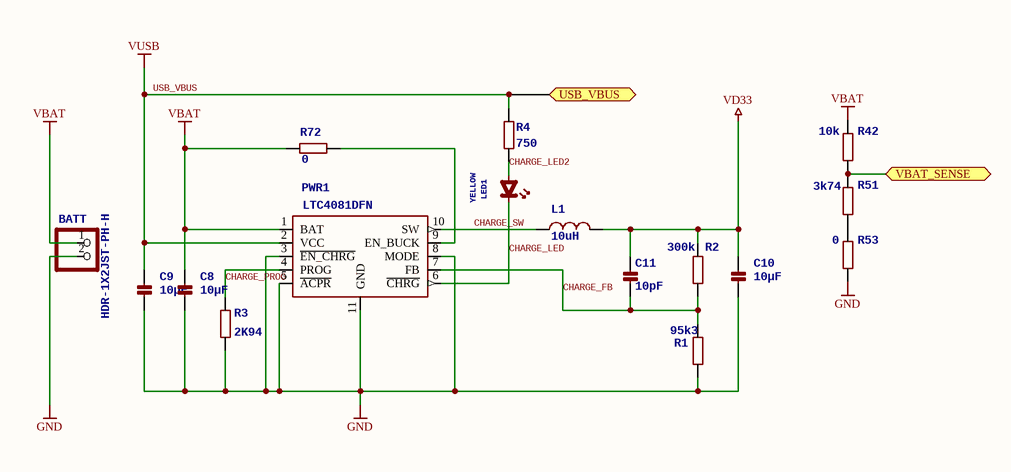
[diagram p11: power_main.SchDoc]

### Parts
BATT  HDR-1X2JST-PH-H  [S2B-PH-SM4-TB]
C8  10µF  [0603]
C9  10µF  [0603]
C10  10µF  [0603]
C11  10pF  [0402]
L1  10uH  [INDUCTOR_40X40]
LED1  YELLOW  [0402_POLAR]
PWR1  LTC4081DFN  [LTC4080_DFN]
R1  95k3  [0402]
R2  300k  [0402]
R3  2K94  [0402]
R4  750  [0402]
R42  10k  [0402]
R51  3k74  [0402]
R53  0  [0402]
R72  0  [0805 v3]

### Ports
USB_VBUS, VBAT_SENSE

### Nets
GND: BATT.2 C8.2(P2) C9.2(P2) C10.2(P2) PWR1.3(~{EN_CHRG}) PWR1.5(~{ACPR}) PWR1.8(MODE) PWR1.11(GND) R1.1 R3.1 R53.1
USB_VBUS: C9.1(P1) PWR1.2(VCC) R4.2 ; port USB_VBUS  [also labelled VUSB]
VBAT: BATT.1 C8.1(P1) PWR1.1(BAT) R42.2 R72.2
VD33: C10.1(P1) C11.1 L1.2 R2.2
CHARGE_FB: C11.2 PWR1.7(FB) R1.2 R2.1
CHARGE_LED: LED1.K(CATHODE) PWR1.6(~{CHRG})
CHARGE_LED2: LED1.A(ANODE) R4.1
CHARGE_PROG: PWR1.4(PROG) R3.2
CHARGE_SW: L1.1 PWR1.10(SW)
VBAT_SENSE: R42.1 R51.2 ; port VBAT_SENSE
NetPWR1_9: PWR1.9(EN_BUCK) R72.1
NetR51_1: R51.1 R53.2

### Library data of the parts
BATT = HEADER-1X2JST-PH-H: LI-Poly battery connector; SMD: Yes
C8-C10 = CAP_CERAMIC0603: Ceramic Capacitor; SMD: Yes
C11 = CAP_CERAMIC0402: Ceramic Capacitor; SMD: Yes
L1 = INDUCTOR40X40MM: Generic inductor; SMD: Yes
LED1 = LED0402: LED common; SMD: Yes
PWR1 = LTC4080DFN: Linear Technology Li-Ion battery charger and buck regulator; SMD: Yes
R1-R4 R42 R51 R53 R72 = R-EU_0402: RESISTOR; SMD: Yes

## Nets that join several sheets
GND: WunderBar_v102b (37 pins), WiFi_module_main (6 pins), Nordic_main (19 pins), USB_IO_main (P1_GND.1 USB.5_GND USB.SHIELD), Programming_main (9 pins), module 1_LIGHT (35 pins), module 2_ACCEL_GYRO (35 pins), module 3_GROVE (35 pins), module 4_TEMP_HUMIDITY (30 pins), module 5_IR TRANSMITTER (32 pins), module 6_MIC (46 pins), power_main (11 pins)
USB_VBUS: WunderBar_v102b (R30.1 U1.G2), USB_IO_main (USB.1_VBUS), power_main (C9.1 PWR1.2 R4.2)
VD33: WunderBar_v102b (19 pins), WiFi_module_main (5 pins), Nordic_main (7 pins), USB_IO_main (VD33.1), Programming_main (LPC_DEBUG.1 NRF_DEBUG.1 WIFI_DEBUG.1), module 1_LIGHT (25 pins), module 2_ACCEL_GYRO (22 pins), module 3_GROVE (16 pins), module 4_TEMP_HUMIDITY (18 pins), module 5_IR TRANSMITTER (17 pins), module 6_MIC (17 pins), power_main (C10.1 C11.1 L1.2 R2.2)
BT1_SWDIO: WunderBar_v102b (U1.A6), USB_IO_main (P2_11.1), module 1_LIGHT (BT1.23 DEBUG1.2)
BT2_SWDIO: WunderBar_v102b (U1.A7), USB_IO_main (P2_13.1), module 2_ACCEL_GYRO (BT2.23 DEBUG2.2)
BT3_SWDIO: WunderBar_v102b (U1.A8), USB_IO_main (P2_5.1), module 3_GROVE (BT3.23 DEBUG3.2)
BT4_SWDIO: WunderBar_v102b (U1.D11), USB_IO_main (P1_14.1), module 4_TEMP_HUMIDITY (BT4.23 DEBUG4.2)
BT5_SWDIO: WunderBar_v102b (U1.C11), USB_IO_main (P1_19.1), module 5_IR TRANSMITTER (BT5.23 DEBUG5.2)
BT6_SWDIO: WunderBar_v102b (U1.B11), USB_IO_main (P6_2.1), module 6_MIC (BT6.23 DEBUG6.2)
BT_MCU_GP1: WunderBar_v102b (U1.J9), Nordic_main (BT.6)
BT_MCU_GP2: WunderBar_v102b (U1.L8), Nordic_main (BT.8)
BT_SPI_MISO: WunderBar_v102b (U1.H10), Nordic_main (BT.4)
BT_SPI_MOSI: WunderBar_v102b (U1.J10), Nordic_main (BT.5)
BT_SPI_SCK: WunderBar_v102b (U1.L9), Nordic_main (BT.9)
BT_SPI_SSEL: WunderBar_v102b (U1.K9), Nordic_main (BT.7)
BT_SWDCLK: WunderBar_v102b (U1.D8), Nordic_main (BT.24 R31.2), Programming_main (NRF_DEBUG.4), module 1_LIGHT (BT1.24 DEBUG1.4 R32.2), module 2_ACCEL_GYRO (BT2.24 DEBUG2.4 R35.2), module 3_GROVE (BT3.24 DEBUG3.4 R33.2), module 4_TEMP_HUMIDITY (BT4.24 DEBUG4.4 R34.2), module 5_IR TRANSMITTER (BT5.24 DEBUG5.4 R37.2), module 6_MIC (BT6.24 DEBUG6.4 R36.2)
BT_SWDIO: WunderBar_v102b (U1.H5), Nordic_main (BT.23), Programming_main (NRF_DEBUG.2)
~{LPC_RESET}: WunderBar_v102b (R38.1 RST.P1 RST.P2 U1.J11), Programming_main (LPC_DEBUG.10)
LPC_SWDCLK: WunderBar_v102b (R15.1 U1.J6), Programming_main (LPC_DEBUG.4)
LPC_SWDIO: WunderBar_v102b (R41.1 U1.H9), Programming_main (LPC_DEBUG.2)
LPC_SWO: WunderBar_v102b (R14.1 U1.J7), Programming_main (LPC_DEBUG.6)
LPC_TDI: WunderBar_v102b (R39.1 U1.H8), Programming_main (LPC_DEBUG.8)
USB_DM: WunderBar_v102b (U1.F2), USB_IO_main (R70.2)
USB_DP: WunderBar_v102b (U1.F1), USB_IO_main (R71.2)
USER_A1: WunderBar_v102b (U1.D10), USB_IO_main (A1.1)
USER_A2: WunderBar_v102b (U1.C10), USB_IO_main (A2.1)
USER_A3: WunderBar_v102b (U1.F11), USB_IO_main (A3.1)
USER_A4: WunderBar_v102b (U1.E11), USB_IO_main (A4.1)
USER_I2C_SCL: WunderBar_v102b (U1.G11), USB_IO_main (SCL.1)
USER_I2C_SDA: WunderBar_v102b (U1.G10), USB_IO_main (SDA.1)
USER_SD_CLK: WunderBar_v102b (U1.E2), USB_IO_main (SD_CLK.1)
USER_SD_CMD: WunderBar_v102b (U1.F4), USB_IO_main (SD_CMD.1)
USER_SD_D0: WunderBar_v102b (U1.E3), USB_IO_main (SD_D0.1)
USER_SD_D1: WunderBar_v102b (U1.E4), USB_IO_main (SD_D1.1)
USER_SD_D2: WunderBar_v102b (U1.G4), USB_IO_main (SD_D2.1)
USER_SD_D3: WunderBar_v102b (U1.H7), USB_IO_main (SD_D3.1)
VBAT_SENSE: WunderBar_v102b (U1.H3), power_main (R42.1 R51.2)
WIFI_!RESET: WunderBar_v102b (U1.A2), WiFi_module_main (R11.1 WIFI.47)
WIFI_ALARM1: WunderBar_v102b (U1.A9), WiFi_module_main (WIFI.7)
WIFI_INTF_SEL: WunderBar_v102b (R52.1), WiFi_module_main (WIFI.35)
WIFI_JTAG_!NTRST: WiFi_module_main (WIFI.6), Programming_main (WIFI_DEBUG.10)
WIFI_JTAG_TCK: WiFi_module_main (WIFI.2), Programming_main (WIFI_DEBUG.4)
WIFI_JTAG_TDI: WiFi_module_main (WIFI.4), Programming_main (WIFI_DEBUG.8)
WIFI_JTAG_TDO: WiFi_module_main (WIFI.3), Programming_main (WIFI_DEBUG.6)
WIFI_JTAG_TMS: WiFi_module_main (WIFI.5), Programming_main (WIFI_DEBUG.2)
WIFI_PGM: WunderBar_v102b (U1.F3), WiFi_module_main (R8.2 WIFI.36)
WIFI_RTC_OUT: WunderBar_v102b (U1.B10), WiFi_module_main (WIFI.8)
WIFI_SPI_IRQ: WunderBar_v102b (U1.B1), WiFi_module_main (WIFI.46)
WIFI_SPI_MISO: WunderBar_v102b (U1.D1), WiFi_module_main (WIFI.27)
WIFI_SPI_MOSI: WunderBar_v102b (U1.D2), WiFi_module_main (WIFI.30)
WIFI_SPI_SCK: WunderBar_v102b (U1.C1), WiFi_module_main (WIFI.28)
WIFI_SPI_SSEL: WunderBar_v102b (U1.C2), WiFi_module_main (WIFI.29)
WIFI_UART_RX_LPC_TX: WunderBar_v102b (U1.A1), WiFi_module_main (WIFI.41)
WIFI_UART_TX_LPC_RX: WunderBar_v102b (U1.B2), WiFi_module_main (WIFI.39)